# Altium project take1.PrjPcb
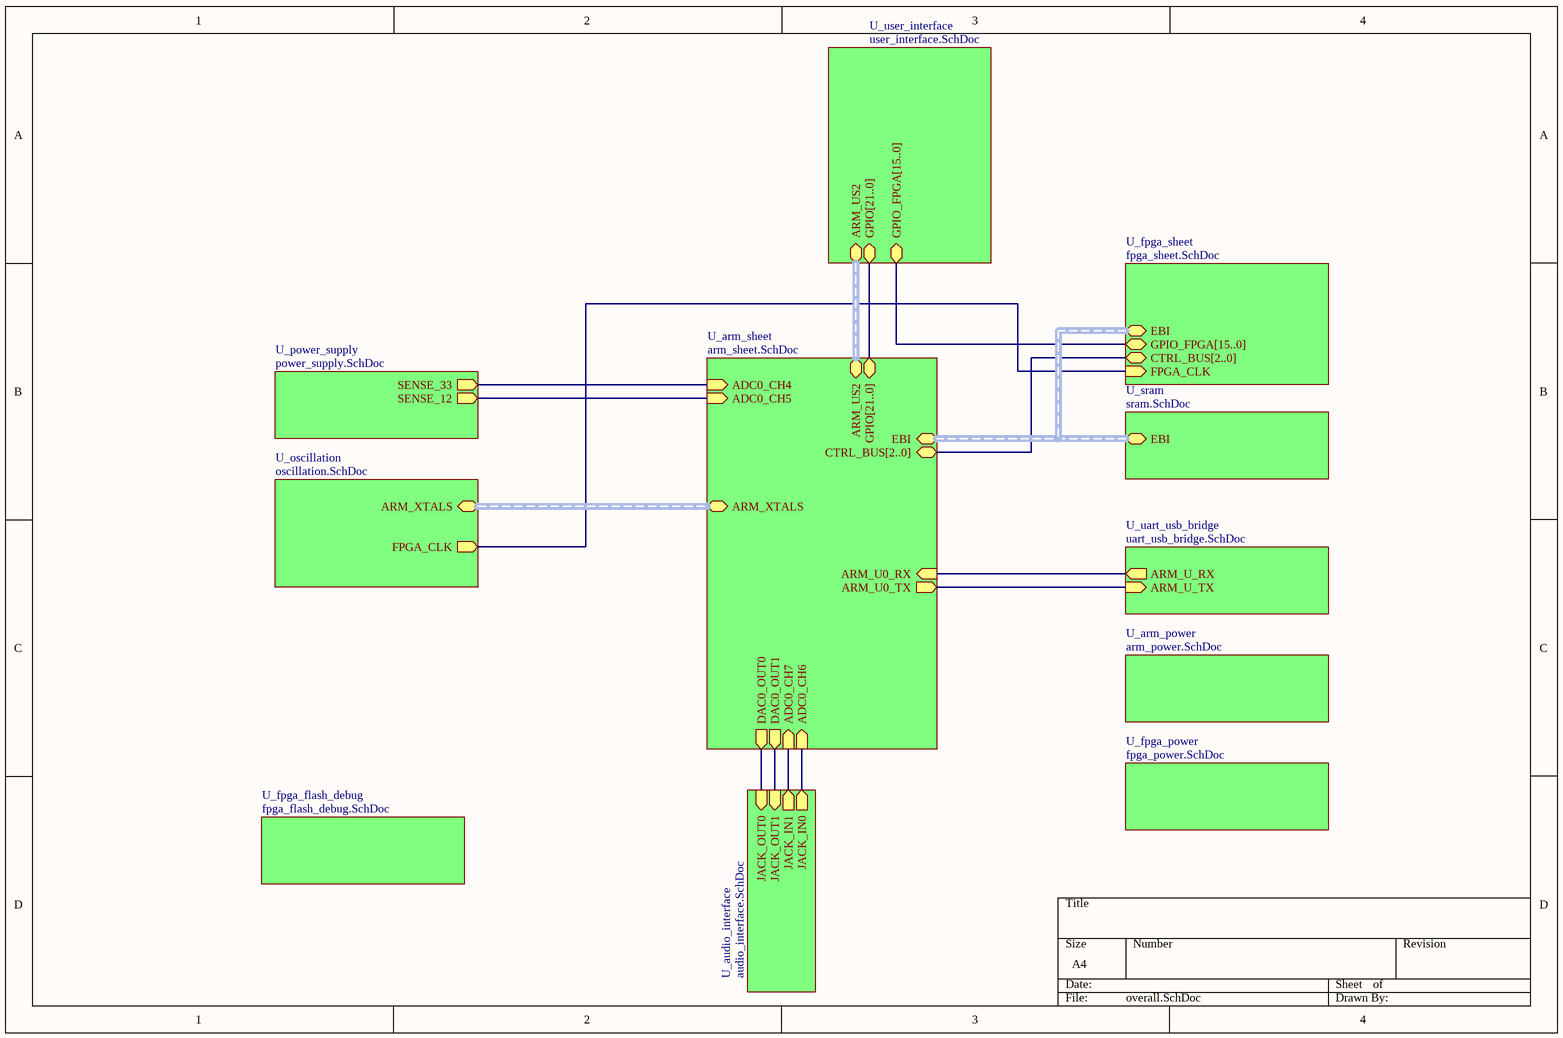
[diagram p0: overall.SchDoc]
12 sheets, 174 parts. Net scope: hierarchical (ports join the sheet entries above them; power ports are global).
Board files: pcb_take1.PcbDoc, pcb_take2-1.PcbDoc, pcb_take2.PcbDoc
Sheets:
  overall.SchDoc
    U_arm_power = arm_power.SchDoc
    U_arm_sheet = arm_sheet.SchDoc
    U_fpga_power = fpga_power.SchDoc
    U_oscillation = oscillation.SchDoc
    U_uart_usb_bridge = uart_usb_bridge.SchDoc
    U_user_interface = user_interface.SchDoc
    U_power_supply = power_supply.SchDoc
    U_fpga_sheet = fpga_sheet.SchDoc
    U_fpga_flash_debug = fpga_flash_debug.SchDoc
    U_audio_interface = audio_interface.SchDoc
    U_sram = sram.SchDoc

## Sheet overall.SchDoc
size A4

### Sub-sheets
U_arm_power = arm_power.SchDoc: no entries
U_arm_sheet = arm_sheet.SchDoc: ARM_U0_TX (out), ARM_U0_RX (in), ADC0_CH4 (in), ADC0_CH5 (in), ADC0_CH6 (in), ADC0_CH7 (in), CTRL_BUS[2..0] (bidir), ARM_XTALS (harness ARM_XTALS), ARM_US2 (harness ARM_US2), DAC0_OUT0 (out), DAC0_OUT1 (out), GPIO[21..0] (bidir), EBI (harness EBI)
U_audio_interface = audio_interface.SchDoc: JACK_IN0 (out), JACK_IN1 (out), JACK_OUT0 (in), JACK_OUT1 (in)
U_fpga_flash_debug = fpga_flash_debug.SchDoc: no entries
U_fpga_power = fpga_power.SchDoc: no entries
U_fpga_sheet = fpga_sheet.SchDoc: GPIO_FPGA[15..0] (bidir), CTRL_BUS[2..0] (bidir), FPGA_CLK (in), EBI (harness EBI)
U_oscillation = oscillation.SchDoc: FPGA_CLK (out), ARM_XTALS (harness ARM_XTALS)
U_power_supply = power_supply.SchDoc: SENSE_33 (out), SENSE_12 (out)
U_sram = sram.SchDoc: EBI (harness EBI)
U_uart_usb_bridge = uart_usb_bridge.SchDoc: ARM_U_TX (in), ARM_U_RX (out)
U_user_interface = user_interface.SchDoc: GPIO_FPGA[15..0] (bidir), GPIO[21..0] (bidir), ARM_US2 (harness ARM_US2)

### Nets
NetC62_1: sheet U_arm_sheet/ADC0_CH6, sheet U_audio_interface/JACK_IN0
NetC66_1: sheet U_arm_sheet/ADC0_CH7, sheet U_audio_interface/JACK_IN1
NetCG1_3: sheet U_oscillation/FPGA_CLK, sheet U_fpga_sheet/FPGA_CLK
NetGG_A6: sheet U_arm_sheet/ARM_U0_RX, sheet U_uart_usb_bridge/ARM_U_RX
NetGG_B7: sheet U_arm_sheet/ARM_U0_TX, sheet U_uart_usb_bridge/ARM_U_TX
NetGG_H9: sheet U_arm_sheet/ADC0_CH5, sheet U_power_supply/SENSE_12
NetGG_J11: sheet U_arm_sheet/ADC0_CH4, sheet U_power_supply/SENSE_33
NetGG_L5: sheet U_arm_sheet/DAC0_OUT0, sheet U_audio_interface/JACK_OUT0
NetGG_L6: sheet U_arm_sheet/DAC0_OUT1, sheet U_audio_interface/JACK_OUT1

### Buses and harness runs
bus sheet U_arm_sheet/CTRL_BUS[2..0] = sheet U_fpga_sheet/CTRL_BUS[2..0]
bus sheet U_arm_sheet/GPIO[21..0] = sheet U_user_interface/GPIO[21..0]
bus sheet U_fpga_sheet/GPIO_FPGA[15..0] = sheet U_user_interface/GPIO_FPGA[15..0]
harness sheet U_arm_sheet/ARM_US2 = sheet U_user_interface/ARM_US2
harness sheet U_arm_sheet/ARM_XTALS = sheet U_oscillation/ARM_XTALS
harness sheet U_arm_sheet/EBI = sheet U_fpga_sheet/EBI = sheet U_sram/EBI

## Sheet arm_power.SchDoc
size A4
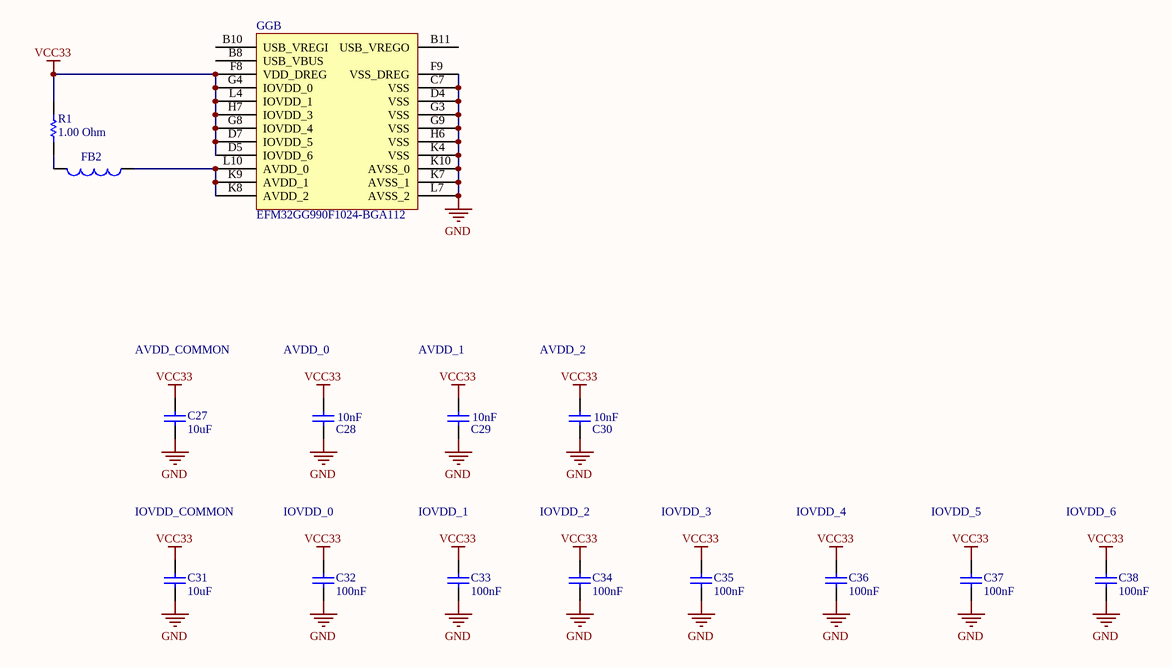
[diagram p1: arm_power.SchDoc]

### Parts
C27  10uF  [CAPC0805(2012)145_N]
C28  10nF  [CAPC0805(2012)75_N]
C29  10nF  [CAPC0805(2012)75_N]
C30  10nF  [CAPC0805(2012)75_N]
C31  10uF  [CAPC0805(2012)145_N]
C32  100nF  [CAPC0805(2012)100_M]
C33  100nF  [CAPC0805(2012)100_M]
C34  100nF  [CAPC0805(2012)100_M]
C35  100nF  [CAPC0805(2012)100_M]
C36  100nF  [CAPC0805(2012)100_M]
C37  100nF  [CAPC0805(2012)100_M]
C38  100nF  [CAPC0805(2012)100_M]
FB2  BLM21B102S or similar  [RESC3216N]  (value not drawn)
GG  EFM32GG990F1024-BGA112  [ENMR-BGA112]  (part B of 2)
R1  1.00 Ohm  [RESC0805(2012)_L]

### Nets
GND: C27.1 C28.1 C29.1 C30.1 C31.1 C32.1 C33.1 C34.1 C35.1 C36.1 C37.1 C38.1 GG.C7(VSS) GG.D4(VSS) GG.F9(VSS_DREG) GG.G3(VSS) GG.G9(VSS) GG.H6(VSS) GG.K4(VSS) GG.K7(AVSS_1) GG.K10(AVSS_0) GG.L7(AVSS_2)
VCC33: C27.2 C28.2 C29.2 C30.2 C31.2 C32.2 C33.2 C34.2 C35.2 C36.2 C37.2 C38.2 GG.D5(IOVDD_6) GG.D7(IOVDD_5) GG.F8(VDD_DREG) GG.G4(IOVDD_0) GG.G8(IOVDD_4) GG.H7(IOVDD_3) GG.L4(IOVDD_1) R1.2
NetFB2_1: FB2.1 GG.K8(AVDD_2) GG.K9(AVDD_1) GG.L10(AVDD_0)
NetFB2_2: FB2.2 R1.1

Not connected (* = marked no-connect by the designer): GG B8(USB_VBUS) B10(USB_VREGI) B11(USB_VREGO)

### Notes on the sheet
- AVDD_COMMON
- AVDD_0
- AVDD_1
- AVDD_2
- IOVDD_COMMON
- IOVDD_0
- IOVDD_1
- IOVDD_2
- IOVDD_3
- IOVDD_4
- IOVDD_5
- IOVDD_6

### Library data of the parts
C27 C31 = CMP-1036-04932-1: CAP 10uF 25V ±10% 0805 (2012 Metric) Thickness 1.45mm SMD; Case-EIA: 0805; Case-Metric: 2012; Technology: SMT; Value: 10uF; Rated Voltage: 25 V; Max Thickness: 1.45 mm; Tolerance: ±10%
C28-C30 = CMP-1036-03842-1: CAP 10nF 50V ±10% 0805 (2012 Metric) Thickness 0.75mm SMD; Case-Metric: 2012; Case-EIA: 0805; Value: 10nF; Max Thickness: 0.75 mm; Rated Voltage: 50 V; Tolerance: ±10%; Technology: SMT
C32-C38 = CMP-1036-04420-1: CAP 100nF 50V ±10% 0805 (2012 Metric) Thickness 1mm SMD; Case-EIA: 0805; Case-Metric: 2012; Rated Voltage: 50 V; Value: 100nF; Tolerance: ±10%; Max Thickness: 1 mm; Technology: SMT
FB2 = Inductor: Code_IEC: 1005; Value: 10mH; Published: 8-Jun-2000; LatestRevisionDate: 29-May-2009; LatestRevisionNote: IPC-7351 Footprint Added.; PackageReference: 0402-A; Publisher: Altium Limited; PackageDescription: Chip Inductor; Code_JEITA: 0402
GG = EFM32GG990F1024-BGA112: EFM32 Giant Gecko, M3 ARM Cortex CPU, 1024 KB Flash, 128 KB RAM, 1.85 - 3.8 V Supply, 48 MHz Max Speed, -40 to 85 degC, 112-Pin BGA, RoHS Compliant; Flash (KB): 1024; GPIO: 87; LCD: 8x34; LESENSE: Y; Max Speed (MHz): 48; OPAMPS: 3; RAM (KB): 128; DatasheetVersion: Rev 1.00; PackageVersion: Rev. 97SPP01315A_X03_06Jun11; PackageReference: BGA112; PackageDescription: 112-Pin Ball Grid Array, Body 10 x 10 mm, Pitch 0.8 mm; Supplier 1: Digi-Key; Supplier Part Number 1: 914-1051-2-ND; Supplier 2: Digi-Key; Supplier Part Number 2: 914-1051-1-ND; Supplier 3: Digi-Key; Supplier Part Number 3: 914-1051-6-ND; Supplier 4: Mouser; Supplier Part Number 4: 904-EFM32GG990F1024; ARM Cortex CPU: M3; Subcategory: EFM32 Giant Gecko; Supply Voltage (V): 1.85 - 3.8; USB: Y; Mounting Technology: Surface Mount; Generic Part Number: EFM32GG990; PartNumber: EFM32GG990F1024-BGA112; ComponentLink1Description: Manufacturer URL; ComponentLink1URL: http://www.energymicro.com/; ComponentLink2Description: Datasheet; ComponentLink2URL: http://cdn.energymicro.com/dl/devices/pdf/d0046_efm32gg990_datasheet.pdf; ComponentLink3Description: Package Specification; ComponentLink3URL: http://cdn.energymicro.com/dl/devices/pdf/d0007_efm32g290_datasheet.pdf
R1 = CMP-1013-00002-1: 1R 0.125W 5% 0805 (2012 Metric)  SMD; Case-EIA: 0805; Case-Metric: 2012; Power: 0.125 W; Tolerance: 5 %; Value: 1.00 Ohm; Technology: SMT

## Sheet arm_sheet.SchDoc
size A4
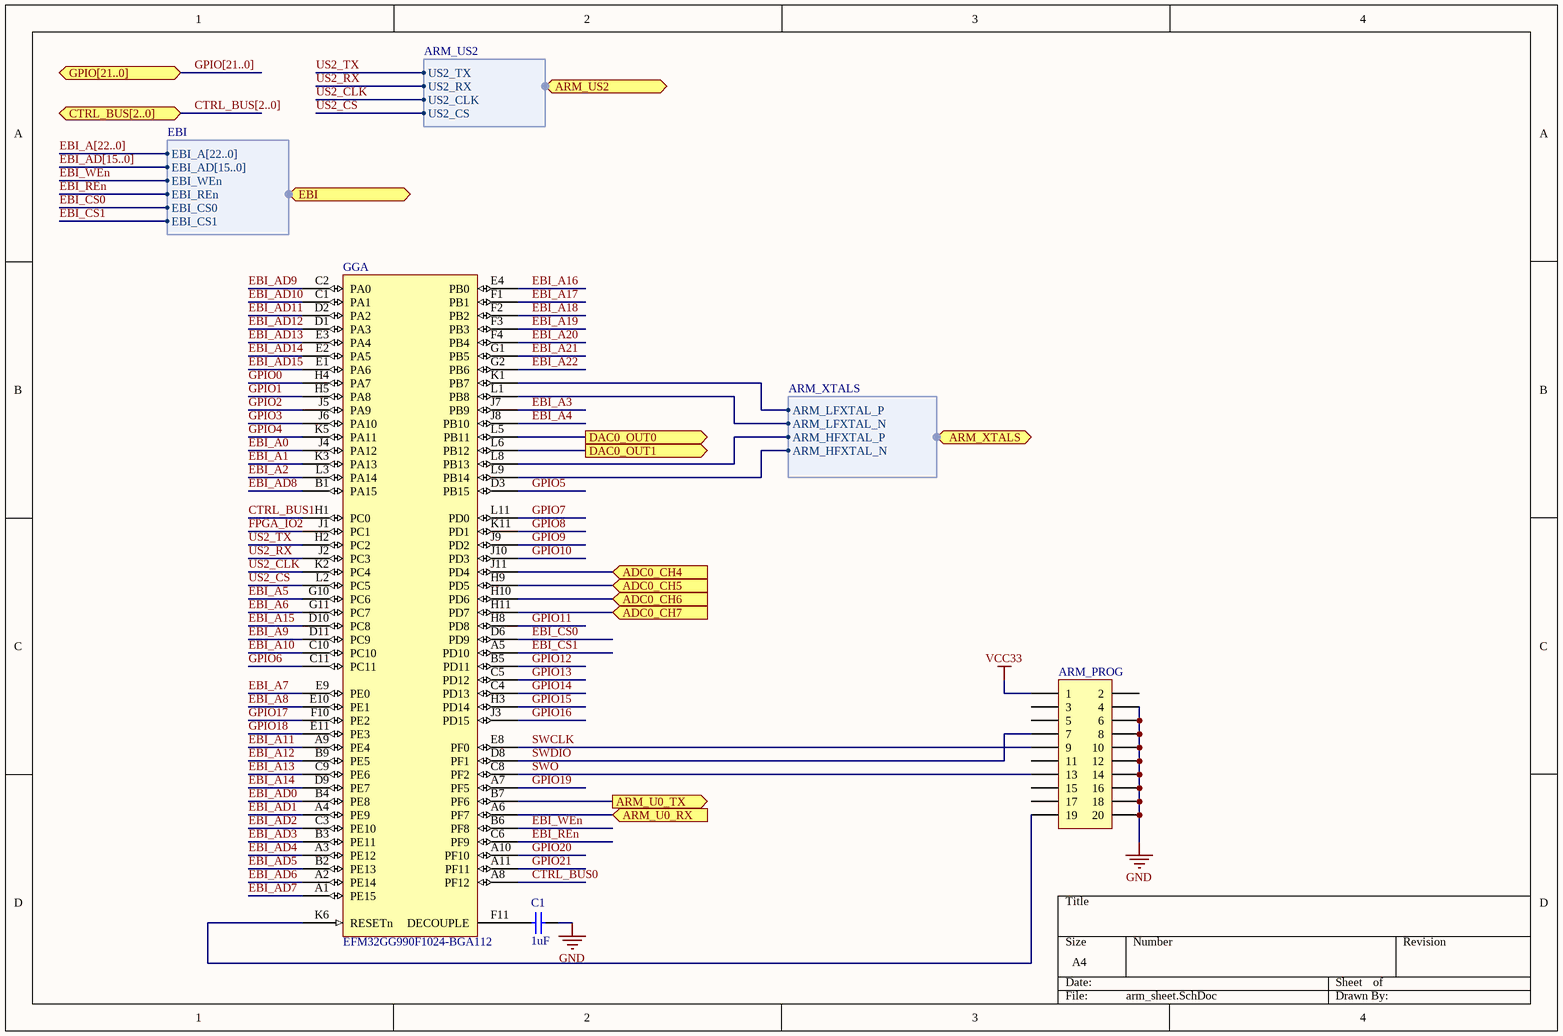
[diagram p2: arm_sheet.SchDoc]

### Parts
ARM_PROG  Header 10X2  [HDR2X10]  (value not drawn)
C1  1uF  [CAPC0805(2012)100_N]
GG  EFM32GG990F1024-BGA112  [ENMR-BGA112]  (part A of 2)

### Ports
ADC0_CH4 (in), ADC0_CH5 (in), ADC0_CH6 (in), ADC0_CH7 (in), ARM_U0_RX (in), ARM_U0_TX (out), ARM_US2 (harness ARM_US2), ARM_XTALS (harness ARM_XTALS), CTRL_BUS[2..0] (bidir), DAC0_OUT0 (out), DAC0_OUT1 (out), EBI (harness EBI), GPIO[21..0] (bidir)

### Harnesses
ARM_XTALS: ARM_LFXTAL_P, ARM_LFXTAL_N, ARM_HFXTAL_P, ARM_HFXTAL_N
EBI: EBI_A[22..0], EBI_AD[15..0], EBI_WEn, EBI_REn, EBI_CS0, EBI_CS1
ARM_US2: US2_TX, US2_RX, US2_CLK, US2_CS

### Nets
GND: ARM_PROG.4 ARM_PROG.6 ARM_PROG.8 ARM_PROG.10 ARM_PROG.12 ARM_PROG.14 ARM_PROG.16 ARM_PROG.18 ARM_PROG.20 C1.2
VCC33: ARM_PROG.1
ARM_HFXTAL_N: GG.L9(PB14) ; port ARM_XTALS.ARM_HFXTAL_N
ARM_HFXTAL_P: GG.L8(PB13) ; port ARM_XTALS.ARM_HFXTAL_P
ARM_LFXTAL_N: GG.L1(PB8) ; port ARM_XTALS.ARM_LFXTAL_N
ARM_LFXTAL_P: GG.K1(PB7) ; port ARM_XTALS.ARM_LFXTAL_P
CTRL_BUS0: GG.A8(PF12)
CTRL_BUS1: GG.H1(PC0)
EBI_A0: GG.J4(PA12)
EBI_A1: GG.K3(PA13)
EBI_A2: GG.L3(PA14)
EBI_A3: GG.J7(PB9)
EBI_A4: GG.J8(PB10)
EBI_A5: GG.G10(PC6)
EBI_A6: GG.G11(PC7)
EBI_A7: GG.E9(PE0)
EBI_A8: GG.E10(PE1)
EBI_A9: GG.D11(PC9)
EBI_A10: GG.C10(PC10)
EBI_A11: GG.A9(PE4)
EBI_A12: GG.B9(PE5)
EBI_A13: GG.C9(PE6)
EBI_A14: GG.D9(PE7)
EBI_A15: GG.D10(PC8)
EBI_A16: GG.E4(PB0)
EBI_A17: GG.F1(PB1)
EBI_A18: GG.F2(PB2)
EBI_A19: GG.F3(PB3)
EBI_A20: GG.F4(PB4)
EBI_A21: GG.G1(PB5)
EBI_A22: GG.G2(PB6)
EBI_AD0: GG.B4(PE8)
EBI_AD1: GG.A4(PE9)
EBI_AD2: GG.C3(PE10)
EBI_AD3: GG.B3(PE11)
EBI_AD4: GG.A3(PE12)
EBI_AD5: GG.B2(PE13)
EBI_AD6: GG.A2(PE14)
EBI_AD7: GG.A1(PE15)
EBI_AD8: GG.B1(PA15)
EBI_AD9: GG.C2(PA0)
EBI_AD10: GG.C1(PA1)
EBI_AD11: GG.D2(PA2)
EBI_AD12: GG.D1(PA3)
EBI_AD13: GG.E3(PA4)
EBI_AD14: GG.E2(PA5)
EBI_AD15: GG.E1(PA6)
EBI_CS0: GG.D6(PD9) ; port EBI.EBI_CS0
EBI_CS1: GG.A5(PD10) ; port EBI.EBI_CS1
EBI_REn: GG.C6(PF9) ; port EBI.EBI_REn
EBI_WEn: GG.B6(PF8) ; port EBI.EBI_WEn
FPGA_IO2: GG.J1(PC1)
GPIO0: GG.H4(PA7)
GPIO1: GG.H5(PA8)
GPIO2: GG.J5(PA9)
GPIO3: GG.J6(PA10)
GPIO4: GG.K5(PA11)
GPIO5: GG.D3(PB15)
GPIO6: GG.C11(PC11)
GPIO7: GG.L11(PD0)
GPIO8: GG.K11(PD1)
GPIO9: GG.J9(PD2)
GPIO10: GG.J10(PD3)
GPIO11: GG.H8(PD8)
GPIO12: GG.B5(PD11)
GPIO13: GG.C5(PD12)
GPIO14: GG.C4(PD13)
GPIO15: GG.H3(PD14)
GPIO16: GG.J3(PD15)
GPIO17: GG.F10(PE2)
GPIO18: GG.E11(PE3)
GPIO19: GG.A7(PF5)
GPIO20: GG.A10(PF10)
GPIO21: GG.A11(PF11)
SWCLK: ARM_PROG.9 GG.E8(PF0)
SWDIO: ARM_PROG.7 GG.D8(PF1)
SWO: ARM_PROG.13 GG.C8(PF2)
US2_CLK: GG.K2(PC4) ; port ARM_US2.US2_CLK
US2_CS: GG.L2(PC5) ; port ARM_US2.US2_CS
US2_RX: GG.J2(PC3) ; port ARM_US2.US2_RX
US2_TX: GG.H2(PC2) ; port ARM_US2.US2_TX
NetARM_PROG_19: ARM_PROG.19 GG.K6(RESETn)
NetC1_1: C1.1 GG.F11(DECOUPLE)
NetC62_1: GG.H10(PD6) ; port ADC0_CH6
NetC66_1: GG.H11(PD7) ; port ADC0_CH7
NetGG_A6: GG.A6(PF7) ; port ARM_U0_RX
NetGG_B7: GG.B7(PF6) ; port ARM_U0_TX
NetGG_H9: GG.H9(PD5) ; port ADC0_CH5
NetGG_J11: GG.J11(PD4) ; port ADC0_CH4
NetGG_L5: GG.L5(PB11) ; port DAC0_OUT0
NetGG_L6: GG.L6(PB12) ; port DAC0_OUT1

Not connected (* = marked no-connect by the designer): ARM_PROG 2 3 5 11 15 17

### Buses and harness runs
bus CTRL_BUS[2..0] = port CTRL_BUS[2..0]
bus EBI_A[22..0]
bus EBI_AD[15..0]
bus GPIO[21..0] = port GPIO[21..0]

### Library data of the parts
ARM_PROG = Header 10X2: Header, 10-Pin, Dual row; LatestRevisionDate: 17-Jul-2002; LatestRevisionNote: Re-released for DXP Platform.; Publisher: Altium Limited
C1 = CMP-1036-04747-1: CAP 1uF 16V ±10% 0805 (2012 Metric) Thickness 1mm SMD; Case-Metric: 2012; Case-EIA: 0805; Tolerance: ±10%; Technology: SMT; Value: 1uF; Rated Voltage: 16 V; Max Thickness: 1 mm
GG = EFM32GG990F1024-BGA112: as GG on sheet arm_power; DatasheetVersion: Rev 1.00; PackageVersion: Rev. 97SPP01315A_X03_06Jun11; PackageReference: BGA112; PackageDescription: 112-Pin Ball Grid Array, Body 10 x 10 mm, Pitch 0.8 mm; Supplier 1: Digi-Key; Supplier Part Number 1: 914-1051-2-ND; Supplier 2: Digi-Key; Supplier Part Number 2: 914-1051-1-ND; Supplier 3: Digi-Key; Supplier Part Number 3: 914-1051-6-ND; Supplier 4: Mouser; Supplier Part Number 4: 904-EFM32GG990F1024; ARM Cortex CPU: M3; Subcategory: EFM32 Giant Gecko; Supply Voltage (V): 1.85 - 3.8; USB: Y; Mounting Technology: Surface Mount; Generic Part Number: EFM32GG990; PartNumber: EFM32GG990F1024-BGA112; ComponentLink1Description: Manufacturer URL; ComponentLink1URL: http://www.energymicro.com/; ComponentLink2Description: Datasheet; ComponentLink2URL: http://cdn.energymicro.com/dl/devices/pdf/d0046_efm32gg990_datasheet.pdf; ComponentLink3Description: Package Specification; ComponentLink3URL: http://cdn.energymicro.com/dl/devices/pdf/d0007_efm32g290_datasheet.pdf

## Sheet fpga_power.SchDoc
size A4
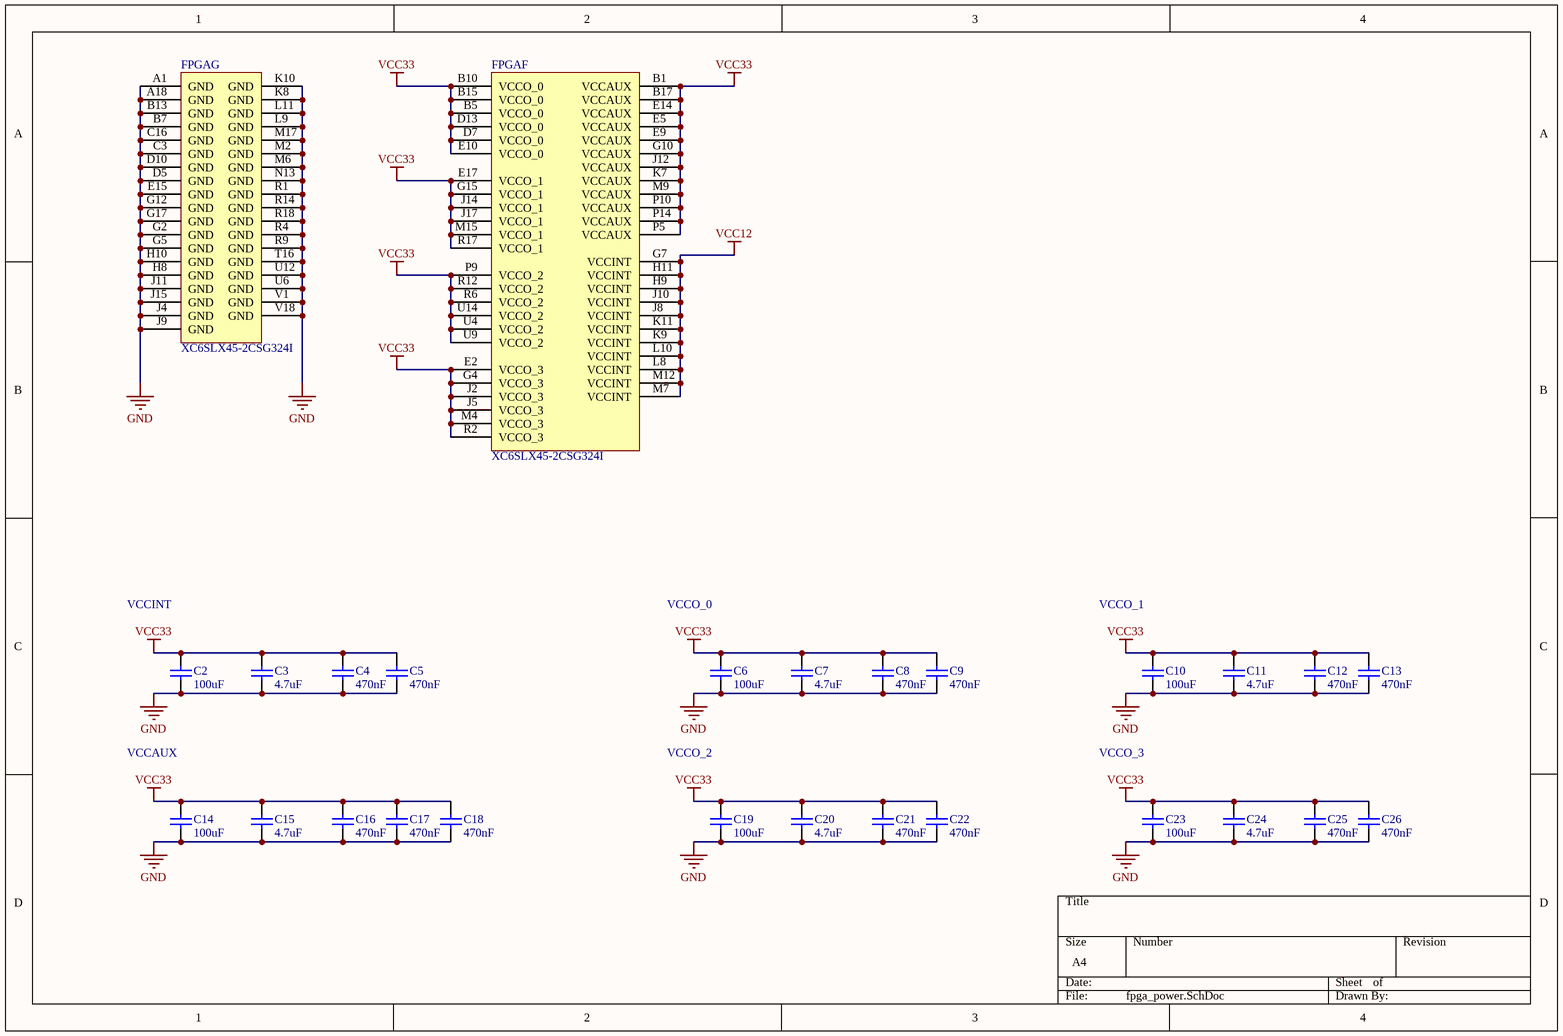
[diagram p3: fpga_power.SchDoc]

### Parts
C2  100uF  [CAPC1210(3225)280A_M]
C3  4.7uF  [CAPC0805(2012)145_N]
C4  470nF  [CAPC0805(2012)100_N]
C5  470nF  [CAPC0805(2012)100_N]
C6  100uF  [CAPC1210(3225)280A_M]
C7  4.7uF  [CAPC0805(2012)145_N]
C8  470nF  [CAPC0805(2012)100_N]
C9  470nF  [CAPC0805(2012)100_N]
C10  100uF  [CAPC1210(3225)280A_M]
C11  4.7uF  [CAPC0805(2012)145_N]
C12  470nF  [CAPC0805(2012)100_N]
C13  470nF  [CAPC0805(2012)100_N]
C14  100uF  [CAPC1210(3225)280A_M]
C15  4.7uF  [CAPC0805(2012)145_N]
C16  470nF  [CAPC0805(2012)100_N]
C17  470nF  [CAPC0805(2012)100_N]
C18  470nF  [CAPC0805(2012)100_N]
C19  100uF  [CAPC1210(3225)280A_M]
C20  4.7uF  [CAPC0805(2012)145_N]
C21  470nF  [CAPC0805(2012)100_N]
C22  470nF  [CAPC0805(2012)100_N]
C23  100uF  [CAPC1210(3225)280A_M]
C24  4.7uF  [CAPC0805(2012)145_N]
C25  470nF  [CAPC0805(2012)100_N]
C26  470nF  [CAPC0805(2012)100_N]
FPGA  XC6SLX45-2CSG324I  [CSG324]  (parts F,G of 8)

### Nets
GND: C2.1 C3.1 C4.1 C5.1 C6.1 C7.1 C8.1 C9.1 C10.1 C11.1 C12.1 C13.1 C14.1 C15.1 C16.1 C17.1 C18.1 C19.1 C20.1 C21.1 C22.1 C23.1 C24.1 C25.1 C26.1 FPGA.A1(GND) FPGA.A18(GND) FPGA.B7(GND) FPGA.B13(GND) FPGA.C3(GND) FPGA.C16(GND) FPGA.D5(GND) FPGA.D10(GND) FPGA.E15(GND) FPGA.G2(GND) FPGA.G5(GND) FPGA.G12(GND) FPGA.G17(GND) FPGA.H8(GND) FPGA.H10(GND) FPGA.J4(GND) FPGA.J9(GND) FPGA.J11(GND) FPGA.J15(GND) FPGA.K8(GND) FPGA.K10(GND) FPGA.L9(GND) FPGA.L11(GND) FPGA.M2(GND) FPGA.M6(GND) FPGA.M17(GND) FPGA.N13(GND) FPGA.R1(GND) FPGA.R4(GND) FPGA.R9(GND) FPGA.R14(GND) FPGA.R18(GND) FPGA.T16(GND) FPGA.U6(GND) FPGA.U12(GND) FPGA.V1(GND) FPGA.V18(GND)
VCC12: FPGA.G7(VCCINT) FPGA.H9(VCCINT) FPGA.H11(VCCINT) FPGA.J8(VCCINT) FPGA.J10(VCCINT) FPGA.K9(VCCINT) FPGA.K11(VCCINT) FPGA.L8(VCCINT) FPGA.L10(VCCINT) FPGA.M7(VCCINT) FPGA.M12(VCCINT)
VCC33: C2.2 C3.2 C4.2 C5.2 C6.2 C7.2 C8.2 C9.2 C10.2 C11.2 C12.2 C13.2 C14.2 C15.2 C16.2 C17.2 C18.2 C19.2 C20.2 C21.2 C22.2 C23.2 C24.2 C25.2 C26.2 FPGA.B1(VCCAUX) FPGA.B5(VCCO_0) FPGA.B10(VCCO_0) FPGA.B15(VCCO_0) FPGA.B17(VCCAUX) FPGA.D7(VCCO_0) FPGA.D13(VCCO_0) FPGA.E2(VCCO_3) FPGA.E5(VCCAUX) FPGA.E9(VCCAUX) FPGA.E10(VCCO_0) FPGA.E14(VCCAUX) FPGA.E17(VCCO_1) FPGA.G4(VCCO_3) FPGA.G10(VCCAUX) FPGA.G15(VCCO_1) FPGA.J2(VCCO_3) FPGA.J5(VCCO_3) FPGA.J12(VCCAUX) FPGA.J14(VCCO_1) FPGA.J17(VCCO_1) FPGA.K7(VCCAUX) FPGA.M4(VCCO_3) FPGA.M9(VCCAUX) FPGA.M15(VCCO_1) FPGA.P5(VCCAUX) FPGA.P9(VCCO_2) FPGA.P10(VCCAUX) FPGA.P14(VCCAUX) FPGA.R2(VCCO_3) FPGA.R6(VCCO_2) FPGA.R12(VCCO_2) FPGA.R17(VCCO_1) FPGA.U4(VCCO_2) FPGA.U9(VCCO_2) FPGA.U14(VCCO_2)

### Notes on the sheet
- VCCINT
- VCCO_0
- VCCO_1
- VCCAUX
- VCCO_2
- VCCO_3

### Library data of the parts
C2 C6 C10 C14 C19 C23 = CMP-1038-02303-1: CAP 100uF 6.3V ±20% 1210 (3225 Metric) Thickness 2.8mm SMD; Case-Metric: 3225; Case-EIA: 1210; Rated Voltage: 6.3 V; Max Thickness: 2.8 mm; Tolerance: ±20%; Value: 100uF; Technology: SMT
C3 C7 C11 C15 C20 C24 = CMP-1036-04881-1: CAP 4.7uF 10V ±10% 0805 (2012 Metric) Thickness 1.45mm SMD; Case-EIA: 0805; Case-Metric: 2012; Tolerance: ±10%; Technology: SMT; Max Thickness: 1.45 mm; Value: 4.7uF; Rated Voltage: 10 V
C4 C5 C8 C9 C12 C13 C16-C18 C21 C22 C25 C26 = CMP-1036-04639-1: CAP 470nF 16V ±10% 0805 (2012 Metric) Thickness 1mm SMD; Case-EIA: 0805; Case-Metric: 2012; Rated Voltage: 16 V; Max Thickness: 1 mm; Value: 470nF; Tolerance: ±10%; Technology: SMT
FPGA = XC6SLX45-2CSG324I: Spartan-6 LX 1.2V FPGA, 218 User I/Os, 324-Ball Chip-Scale BGA (0.8mm Pitch), Speed Grade 2, Industrial Grade, Pb-Free; DatasheetVersion: ver1.6, Nov-2010; PackageVersion: ver1.1, Nov-2009; PackageReference: CSG324; PackageDescription: 324-Ball Chip-Scale BGA (CSG324) Package, 0.8 mm Pitch; Code_JEDEC: MO-275-KKAC-1; ComponentLink1Description: Manufacturer URL; ComponentLink1URL: http://www.xilinx.com/; ComponentLink2Description: Spartan-6 Datasheet; ComponentLink2URL: http://www.xilinx.com/support/documentation/data_sheets/ds160.pdf; ComponentLink3Description: Spartan-6 Documents; ComponentLink3URL: http://www.xilinx.com/support/documentation/spartan-6.htm

## Sheet oscillation.SchDoc
size A4
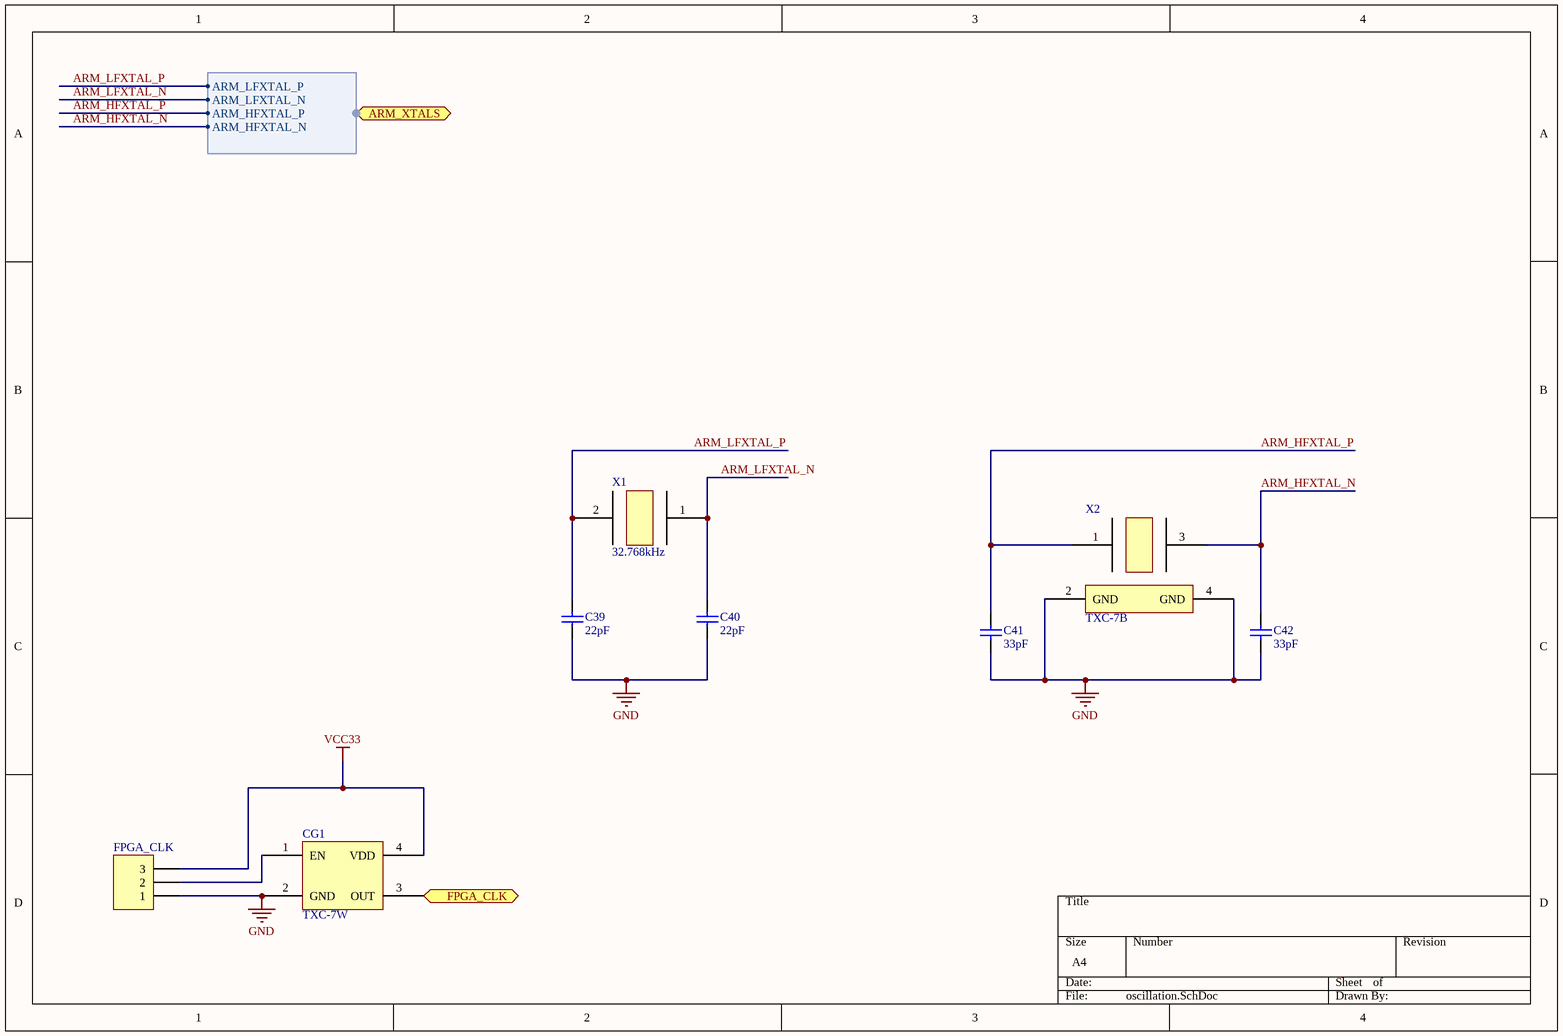
[diagram p4: oscillation.SchDoc]

### Parts
C39  22pF  [CAPC0805(2012)75_L]
C40  22pF  [CAPC0805(2012)75_L]
C41  33pF  [CAPC0805(2012)75_L]
C42  33pF  [CAPC0805(2012)75_L]
CG1  TXC-7W  [TXC-7W]
FPGA_CLK  Header 3  [HDR1X3]  (value not drawn)
X1  32.768kHz  [MC-306]
X2  TXC-7B  [TXC-7B]

### Ports
ARM_XTALS (harness ARM_XTALS), FPGA_CLK (out)

### Harnesses
ARM_XTALS: ARM_LFXTAL_P, ARM_LFXTAL_N, ARM_HFXTAL_P, ARM_HFXTAL_N

### Nets
GND: C39.1 C40.1 C41.2 C42.2 CG1.2(GND) FPGA_CLK.1 X2.2(GND) X2.4(GND)
VCC33: CG1.4(VDD) FPGA_CLK.3
ARM_HFXTAL_N: C42.1 X2.3 ; port ARM_XTALS.ARM_HFXTAL_N
ARM_HFXTAL_P: C41.1 X2.1 ; port ARM_XTALS.ARM_HFXTAL_P
ARM_LFXTAL_N: C40.2 X1.1 ; port ARM_XTALS.ARM_LFXTAL_N
ARM_LFXTAL_P: C39.2 X1.2 ; port ARM_XTALS.ARM_LFXTAL_P
NetCG1_1: CG1.1(EN) FPGA_CLK.2
NetCG1_3: CG1.3(OUT) ; port FPGA_CLK

### Library data of the parts
C39 C40 = CMP-1036-01219-1: CAP 22pF 16V ±5% 0805 (2012 Metric) Thickness 0.75mm SMD; Case-Metric: 2012; Case-EIA: 0805; Technology: SMT; Max Thickness: 0.75 mm; Value: 22pF; Tolerance: ±5%; Rated Voltage: 16 V
C41 C42 = CMP-1036-01407-1: CAP 33pF 16V ±5% 0805 (2012 Metric) Thickness 0.75mm SMD; Case-Metric: 2012; Case-EIA: 0805; Value: 33pF; Max Thickness: 0.75 mm; Technology: SMT; Tolerance: ±5%; Rated Voltage: 16 V
FPGA_CLK = Header 3: Header, 3-Pin; LatestRevisionDate: 17-Jul-2002; LatestRevisionNote: Re-released for DXP Platform.; Publisher: Altium Limited
X1 = MC-306

## Sheet uart_usb_bridge.SchDoc
size A4
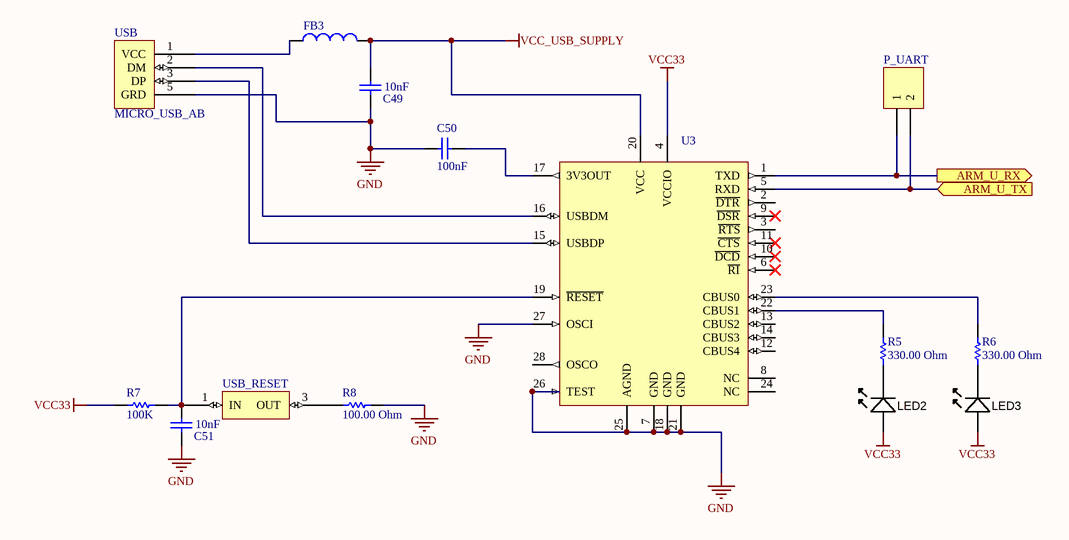
[diagram p5: uart_usb_bridge.SchDoc]

### Parts
C49  10nF  [CAPC0805(2012)75_N]
C50  100nF  [CAPC0805(2012)100_M]
C51  10nF  [CAPC0805(2012)75_N]
FB3  Inductor  [INDC3216]  (value not drawn)
LED2  Red  [LED-0805-A]  (value not drawn)
LED3  Red  [LED-0805-A]  (value not drawn)
P_UART  Header 2  [HDR1X2]  (value not drawn)
R5  330.00 Ohm  [RESC0805(2012)_M]
R6  330.00 Ohm  [RESC0805(2012)_M]
R7  100K  [RESC0805(2012)_L]
R8  100.00 Ohm  [RESC0805(2012)_M]
U3  FT232RL-Reel  [SSOP-28_N]  (value not drawn)
USB  MICRO_USB_AB  [MICRO_USB_AB]
USB_RESET  BUTTON  [BUTTON]  (value not drawn)

### Ports
ARM_U_RX (out), ARM_U_TX (in)

### Nets
GND: C49.1 C50.2 C51.1 R8.2 U3.7(GND) U3.18(GND) U3.21(GND) U3.25(AGND) U3.26(TEST) U3.27(OSCI) USB.5(GRD)
VCC33: LED2.A LED3.A R7.2 U3.4(VCCIO)
VCC_USB_SUPPLY: C49.2 FB3.2 U3.20(VCC)
NetC50_1: C50.1 U3.17(3V3OUT)
NetC51_2: C51.2 R7.1 U3.19(~{RESET}) USB_RESET.1(IN)
NetFB3_1: FB3.1 USB.1(VCC)
NetGG_A6: P_UART.1 U3.1(TXD) ; port ARM_U_RX
NetGG_B7: P_UART.2 U3.5(RXD) ; port ARM_U_TX
NetLED2_K: LED2.K R5.1
NetLED3_K: LED3.K R6.1
NetR5_2: R5.2 U3.22(CBUS1)
NetR6_2: R6.2 U3.23(CBUS0)
NetR8_1: R8.1 USB_RESET.3(OUT)
NetU3_15: U3.15(USBDP) USB.3(DP)
NetU3_16: U3.16(USBDM) USB.2(DM)

Not connected (* = marked no-connect by the designer): U3 2(~{DTR}) 3(~{RTS}) 6(~{RI})* 8(NC) 9(~{DSR})* 10(~{DCD})* 11(~{CTS})* 12(CBUS4) 13(CBUS2) 14(CBUS3) 24(NC) 28(OSCO)

### Library data of the parts
C49 C51 = CMP-1036-03842-1: as C28 on sheet arm_power; Value: 10nF; Max Thickness: 0.75 mm; Rated Voltage: 50 V; Tolerance: ±10%; Technology: SMT
C50 = CMP-1036-04420-1: as C32 on sheet arm_power; Rated Voltage: 50 V; Value: 100nF; Tolerance: ±10%; Max Thickness: 1 mm; Technology: SMT
FB3 = Inductor: Value: 10mH; Code_IEC: 1005; Published: 8-Jun-2000; LatestRevisionDate: 29-May-2009; LatestRevisionNote: IPC-7351 Footprint Added.; PackageReference: 0402-A; Publisher: Altium Limited; PackageDescription: Chip Inductor; Code_JEITA: 0402
LED2 LED3 = LED_SMD_Red_0805: LED, 0805 SMD, Red; Manufacturer 1: Ligitek; Manufacturer Part Number 1: LG170SR-CT; Material: GaAIAs; Ratings: 20 mcd; 643 nm; Package / Case: 0805
P_UART = Header 2: Header, 2-Pin; LatestRevisionDate: 17-Jul-2002; LatestRevisionNote: Re-released for DXP Platform.; Publisher: Altium Limited
R5 R6 = CMP-1013-00454-1: 330R 0.125W 1% 0805 (2012 Metric)  SMD; Case-EIA: 0805; Case-Metric: 2012; Value: 330.00 Ohm; Power: 0.125 W; Tolerance: 1 %; Technology: SMT
R7 = CMP-1013-00122-1: 100K 0.125W 5% 0805 (2012 Metric)  SMD; Case-Metric: 2012; Value: 100000.00 Ohm; Case-EIA: 0805; Tolerance: 5 %; Technology: SMT; Power: 0.125 W
R8 = CMP-1013-00050-1: 100R 0.125W 5% 0805 (2012 Metric)  SMD; Case-EIA: 0805; Case-Metric: 2012; Tolerance: 5 %; Power: 0.125 W; Technology: SMT; Value: 100.00 Ohm
U3 = FT232RL-Reel: USB UART Asynchronous Serial Data Transfer Chip, SSOP-28, Tape and Reel; DatasheetVersion: ver 2.09, Apr-2011; PackageVersion: 2010; PackageReference: SSOP-28; PackageDescription: 28-Pin Small Outline Package 0.65 mm Pitch; ComponentLink1Description: Manufacturer URL; ComponentLink1URL: http://www.ftdichip.com/; ComponentLink2Description: Datasheet; ComponentLink2URL: http://www.ftdichip.com/Support/Documents/DataSheets/ICs/DS_FT232R.pdf

## Sheet user_interface.SchDoc
size A4
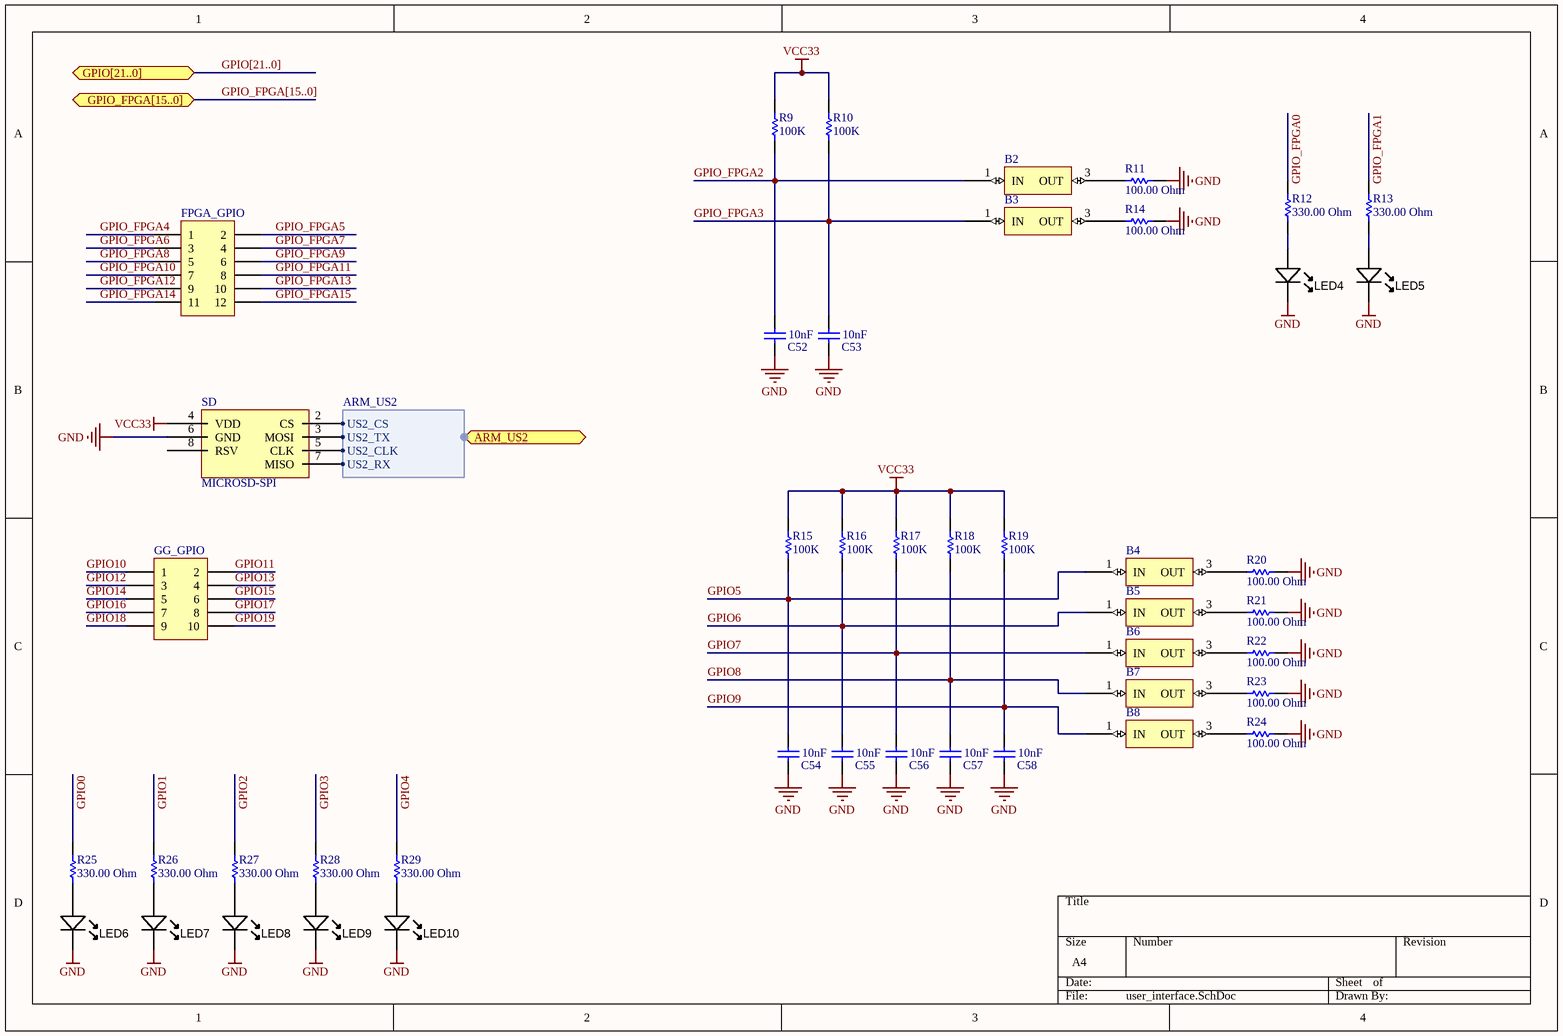
[diagram p6: user_interface.SchDoc]

### Parts
B2  BUTTON  [BUTTON]  (value not drawn)
B3  BUTTON  [BUTTON]  (value not drawn)
B4  BUTTON  [BUTTON]  (value not drawn)
B5  BUTTON  [BUTTON]  (value not drawn)
B6  BUTTON  [BUTTON]  (value not drawn)
B7  BUTTON  [BUTTON]  (value not drawn)
B8  BUTTON  [BUTTON]  (value not drawn)
C52  10nF  [CAPC0805(2012)75_N]
C53  10nF  [CAPC0805(2012)75_N]
C54  10nF  [CAPC0805(2012)75_N]
C55  10nF  [CAPC0805(2012)75_N]
C56  10nF  [CAPC0805(2012)75_N]
C57  10nF  [CAPC0805(2012)75_N]
C58  10nF  [CAPC0805(2012)75_N]
FPGA_GPIO  Header 6X2  [HDR2X6]  (value not drawn)
GG_GPIO  Header 5X2  [HDR2X5]  (value not drawn)
LED4  Green  [LED-0805-K]  (value not drawn)
LED5  Green  [LED-0805-K]  (value not drawn)
LED6  Green  [LED-0805-K]  (value not drawn)
LED7  Green  [LED-0805-K]  (value not drawn)
LED8  Green  [LED-0805-K]  (value not drawn)
LED9  Green  [LED-0805-K]  (value not drawn)
LED10  Green  [LED-0805-K]  (value not drawn)
R9  100K  [RESC0805(2012)_L]
R10  100K  [RESC0805(2012)_L]
R11  100.00 Ohm  [RESC0805(2012)_M]
R12  330.00 Ohm  [RESC0805(2012)_M]
R13  330.00 Ohm  [RESC0805(2012)_M]
R14  100.00 Ohm  [RESC0805(2012)_M]
R15  100K  [RESC0805(2012)_L]
R16  100K  [RESC0805(2012)_L]
R17  100K  [RESC0805(2012)_L]
R18  100K  [RESC0805(2012)_L]
R19  100K  [RESC0805(2012)_L]
R20  100.00 Ohm  [RESC0805(2012)_M]
R21  100.00 Ohm  [RESC0805(2012)_M]
R22  100.00 Ohm  [RESC0805(2012)_M]
R23  100.00 Ohm  [RESC0805(2012)_M]
R24  100.00 Ohm  [RESC0805(2012)_M]
R25  330.00 Ohm  [RESC0805(2012)_M]
R26  330.00 Ohm  [RESC0805(2012)_M]
R27  330.00 Ohm  [RESC0805(2012)_M]
R28  330.00 Ohm  [RESC0805(2012)_M]
R29  330.00 Ohm  [RESC0805(2012)_M]
SD  MICROSD-SPI  [MICROSD_WR-CRD]

### Ports
ARM_US2 (harness ARM_US2), GPIO[21..0] (bidir), GPIO_FPGA[15..0] (bidir)

### Harnesses
ARM_US2: US2_TX, US2_RX, US2_CLK, US2_CS

### Nets
GND: C52.1 C53.1 C54.1 C55.1 C56.1 C57.1 C58.1 LED4.K LED5.K LED6.K LED7.K LED8.K LED9.K LED10.K R11.2 R14.2 R20.2 R21.2 R22.2 R23.2 R24.2 SD.6(GND)
VCC33: R9.2 R10.2 R15.2 R16.2 R17.2 R18.2 R19.2 SD.4(VDD)
GPIO0: R25.2
GPIO1: R26.2
GPIO2: R27.2
GPIO3: R28.2
GPIO4: R29.2
GPIO5: B4.1(IN) C54.2 R15.1
GPIO6: B5.1(IN) C55.2 R16.1
GPIO7: B6.1(IN) C56.2 R17.1
GPIO8: B7.1(IN) C57.2 R18.1
GPIO9: B8.1(IN) C58.2 R19.1
GPIO10: GG_GPIO.1
GPIO11: GG_GPIO.2
GPIO12: GG_GPIO.3
GPIO13: GG_GPIO.4
GPIO14: GG_GPIO.5
GPIO15: GG_GPIO.6
GPIO16: GG_GPIO.7
GPIO17: GG_GPIO.8
GPIO18: GG_GPIO.9
GPIO19: GG_GPIO.10
GPIO_FPGA0: R12.2
GPIO_FPGA1: R13.2
GPIO_FPGA2: B2.1(IN) C52.2 R9.1
GPIO_FPGA3: B3.1(IN) C53.2 R10.1
GPIO_FPGA4: FPGA_GPIO.1
GPIO_FPGA5: FPGA_GPIO.2
GPIO_FPGA6: FPGA_GPIO.3
GPIO_FPGA7: FPGA_GPIO.4
GPIO_FPGA8: FPGA_GPIO.5
GPIO_FPGA9: FPGA_GPIO.6
GPIO_FPGA10: FPGA_GPIO.7
GPIO_FPGA11: FPGA_GPIO.8
GPIO_FPGA12: FPGA_GPIO.9
GPIO_FPGA13: FPGA_GPIO.10
GPIO_FPGA14: FPGA_GPIO.11
GPIO_FPGA15: FPGA_GPIO.12
US2_CLK: SD.5(CLK) ; port ARM_US2.US2_CLK
US2_CS: SD.2(CS) ; port ARM_US2.US2_CS
US2_RX: SD.7(MISO) ; port ARM_US2.US2_RX
US2_TX: SD.3(MOSI) ; port ARM_US2.US2_TX
NetB2_3: B2.3(OUT) R11.1
NetB3_3: B3.3(OUT) R14.1
NetB4_3: B4.3(OUT) R20.1
NetB5_3: B5.3(OUT) R21.1
NetB6_3: B6.3(OUT) R22.1
NetB7_3: B7.3(OUT) R23.1
NetB8_3: B8.3(OUT) R24.1
NetLED4_A: LED4.A R12.1
NetLED5_A: LED5.A R13.1
NetLED6_A: LED6.A R25.1
NetLED7_A: LED7.A R26.1
NetLED8_A: LED8.A R27.1
NetLED9_A: LED9.A R28.1
NetLED10_A: LED10.A R29.1

Not connected (* = marked no-connect by the designer): SD 8(RSV)

### Buses and harness runs
bus GPIO[21..0] = port GPIO[21..0]
bus GPIO_FPGA[15..0] = port GPIO_FPGA[15..0]

### Library data of the parts
C52-C58 = CMP-1036-03842-1: as C28 on sheet arm_power; Value: 10nF; Max Thickness: 0.75 mm; Rated Voltage: 50 V; Tolerance: ±10%; Technology: SMT
FPGA_GPIO = Header 6X2: Header, 6-Pin, Dual row; LatestRevisionDate: 17-Jul-2002; LatestRevisionNote: Re-released for DXP Platform.; Publisher: Altium Limited
GG_GPIO = Header 5X2: Header, 5-Pin, Dual row; LatestRevisionDate: 17-Jul-2002; LatestRevisionNote: Re-released for DXP Platform.; Publisher: Altium Limited
LED4-LED10 = LED_SMD_Green_0805: LED, 0805 SMD, Green; Manufacturer 1: Ligitek; Manufacturer Part Number 1: LG170G-CT; Material: GaP; Ratings: 10 mcd; 573 nm; Package / Case: 0805
R9 R10 R15-R19 = CMP-1013-00122-1: as R7 on sheet uart_usb_bridge; Tolerance: 5 %; Technology: SMT; Power: 0.125 W
R11 R14 R20-R24 = CMP-1013-00050-1: as R8 on sheet uart_usb_bridge; Tolerance: 5 %; Power: 0.125 W; Technology: SMT; Value: 100.00 Ohm
R12 R13 R25-R29 = CMP-1013-00454-1: as R5 on sheet uart_usb_bridge; Value: 330.00 Ohm; Power: 0.125 W; Tolerance: 1 %; Technology: SMT

## Sheet power_supply.SchDoc
size A4
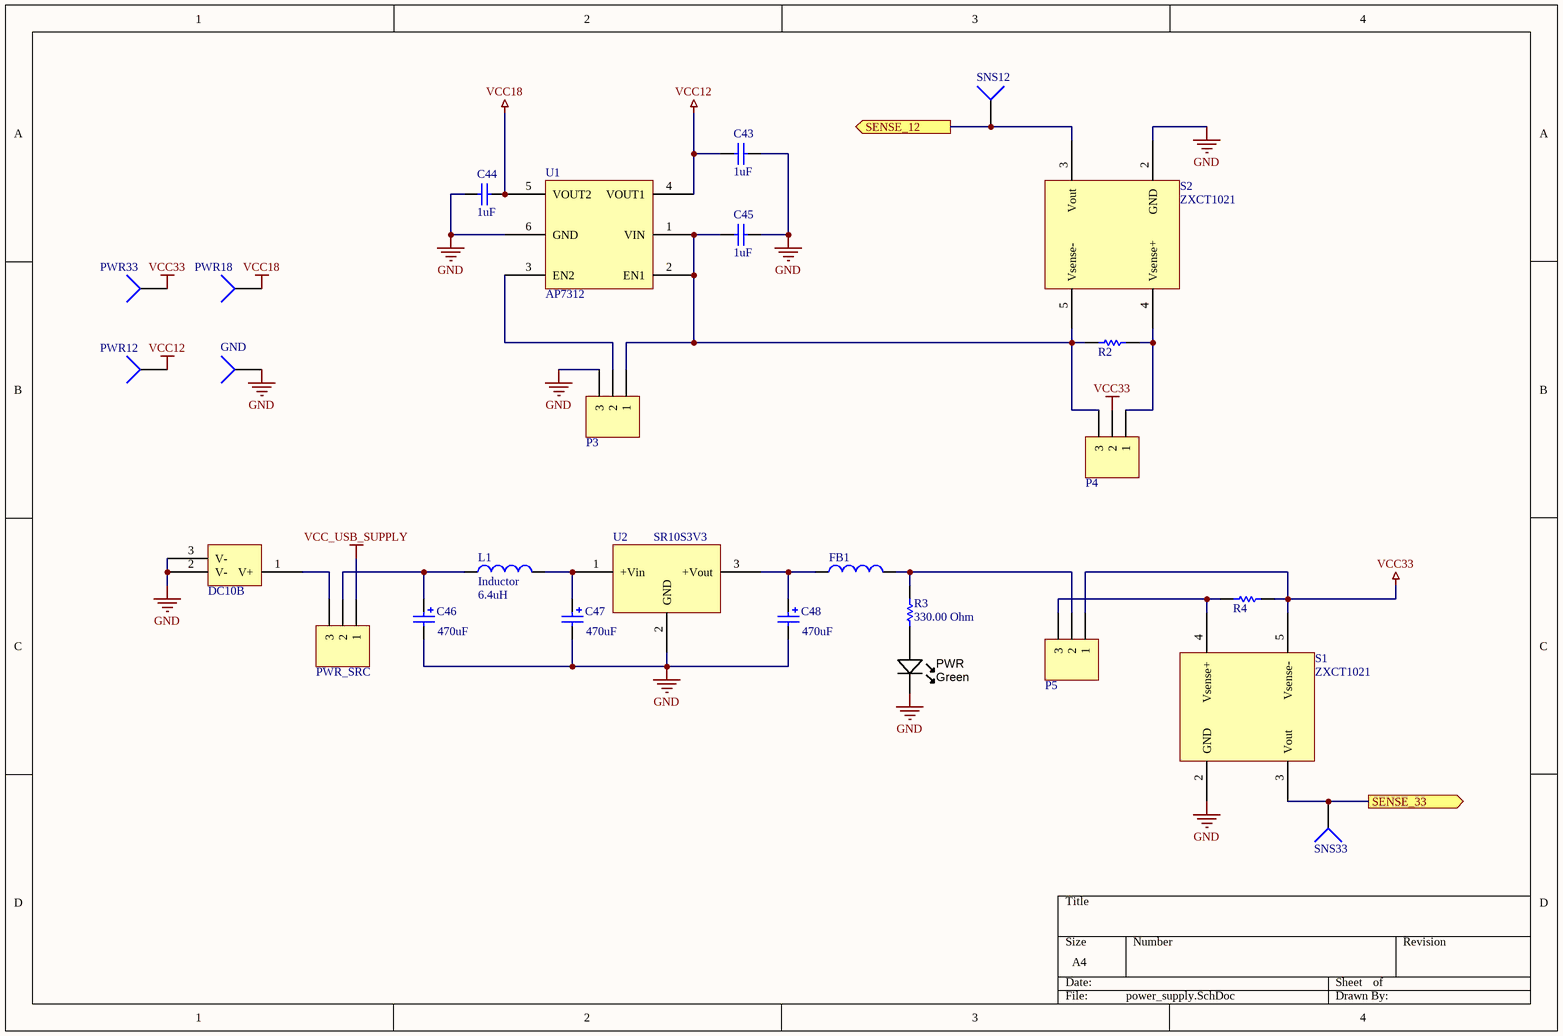
[diagram p7: power_supply.SchDoc]

### Parts
C43  1uF  [CAPC0805(2012)100_N]
C44  1uF  [CAPC0805(2012)100_N]
C45  1uF  [CAPC0805(2012)100_N]
C46  value 470uF  [CAP470uF]  (hidden comment: Cap Pol2)
C47  value 470uF  [CAP470uF]  (hidden comment: Cap Pol2)
C48  value 470uF  [CAP470uF]  (hidden comment: Cap Pol2)
FB1  Inductor  [INDC3216]  (value not drawn)
GND  Socket  [PIN1]  (value not drawn)
L1  Inductor  value 6.4uH  [Coil DRA74-6R8-R]
P3  Header 3  [HDR1X3]  (value not drawn)
P4  Header 3  [HDR1X3]  (value not drawn)
P5  Header 3  [HDR1X3]  (value not drawn)
PWR  Green  [LED-0805-K]
PWR12  Socket  [PIN1]  (value not drawn)
PWR18  Socket  [PIN1]  (value not drawn)
PWR33  Socket  [PIN1]  (value not drawn)
PWR_SRC  Header 3  [HDR1X3]  (value not drawn)
PWRCON  DC10B  [DC-10B]
R2  10R 5% 0805(2012)  [RESC0805(2012)_L]  (value not drawn)
R3  330.00 Ohm  [RESC0805(2012)_M]
R4  10R 5% 0805(2012)  [RESC0805(2012)_L]  (value not drawn)
S1  ZXCT1021  [SOT95P270X145-5N]
S2  ZXCT1021  [SOT95P270X145-5N]
SNS12  Socket  [PIN1]  (value not drawn)
SNS33  Socket  [PIN1]  (value not drawn)
U1  AP7312  [SOT95P285X145-6N]
U2  SR10S3V3  [SR10S3V3_Footprint]

### Ports
SENSE_12 (out), SENSE_33 (out)

### Nets
GND: C43.2 C44.1 C45.2 C46.2 C47.2 C48.2 GND.1 P3.3 PWR.K PWRCON.2(V-) PWRCON.3(V-) S1.2(GND) S2.2(GND) U1.6(GND) U2.2(GND)
VCC12: C43.1 PWR12.1 U1.4(VOUT1)
VCC18: C44.2 PWR18.1 U1.5(VOUT2)
VCC33: P4.2 P5.1 PWR33.1 R4.2 S1.5(Vsense-)
VCC_USB_SUPPLY: PWR_SRC.1
NetC45_1: C45.1 P3.1 P4.3 R2.1 S2.5(Vsense-) U1.1(VIN) U1.2(EN1)
NetC46_1: C46.1 L1.1 PWR_SRC.2
NetC47_1: C47.1 L1.2 U2.1(+Vin)
NetC48_1: C48.1 FB1.1 U2.3(+Vout)
NetFB1_2: FB1.2 P5.2 R3.2
NetGG_H9: S2.3(Vout) SNS12.1 ; port SENSE_12
NetGG_J11: S1.3(Vout) SNS33.1 ; port SENSE_33
NetP3_2: P3.2 U1.3(EN2)
NetP4_1: P4.1 R2.2 S2.4(Vsense+)
NetP5_3: P5.3 R4.1 S1.4(Vsense+)
NetPWR_A: PWR.A R3.1
NetPWR_SRC_3: PWR_SRC.3 PWRCON.1(V+)

### Library data of the parts
C43-C45 = CMP-1036-04747-1: as C1 on sheet arm_sheet; Tolerance: ±10%; Technology: SMT; Value: 1uF; Rated Voltage: 16 V; Max Thickness: 1 mm
C46-C48 = Cap Pol2: Polarized Capacitor (Axial); Published: 8-Jun-2000; LatestRevisionDate: 17-Jul-2002; LatestRevisionNote: Re-released for DXP Platform.; PackageReference: POLAR0.8; Publisher: Altium Limited; PackageDescription: Polarized Capacitor; 2 Leads
FB1 = Inductor: Value: 10mH; Code_IEC: 1005; Published: 8-Jun-2000; LatestRevisionDate: 29-May-2009; LatestRevisionNote: IPC-7351 Footprint Added.; PackageReference: 0402-A; Publisher: Altium Limited; PackageDescription: Chip Inductor; Code_JEITA: 0402
L1 = Inductor: Code_IEC: 1005; Published: 8-Jun-2000; LatestRevisionDate: 29-May-2009; LatestRevisionNote: IPC-7351 Footprint Added.; PackageReference: 0402-A; Publisher: Altium Limited; PackageDescription: Chip Inductor; Code_JEITA: 0402
P3-P5 PWR_SRC = Header 3: Header, 3-Pin; LatestRevisionDate: 17-Jul-2002; LatestRevisionNote: Re-released for DXP Platform.; Publisher: Altium Limited
PWR = LED_SMD_Green_0805: LED, 0805 SMD, Green; Manufacturer 1: Ligitek; Manufacturer Part Number 1: LG170G-CT; Ratings: 10 mcd; 573 nm; Package / Case: 0805; Material: GaP
R2 R4 = CMP-1013-00026-1: 10R 0.125W 5% 0805 (2012 Metric)  SMD; Value: 10.00 Ohm; Case-EIA: 0805; Case-Metric: 2012; Technology: SMT; Power: 0.125 W; Tolerance: 5 %
R3 = CMP-1013-00454-1: as R5 on sheet uart_usb_bridge; Value: 330.00 Ohm; Power: 0.125 W; Tolerance: 1 %; Technology: SMT
GND PWR12 PWR18 PWR33 SNS12 SNS33 = Socket: LatestRevisionDate: 17-Jul-2002; LatestRevisionNote: Re-released for DXP Platform.; Publisher: Altium Limited

## Sheet fpga_sheet.SchDoc
size A4
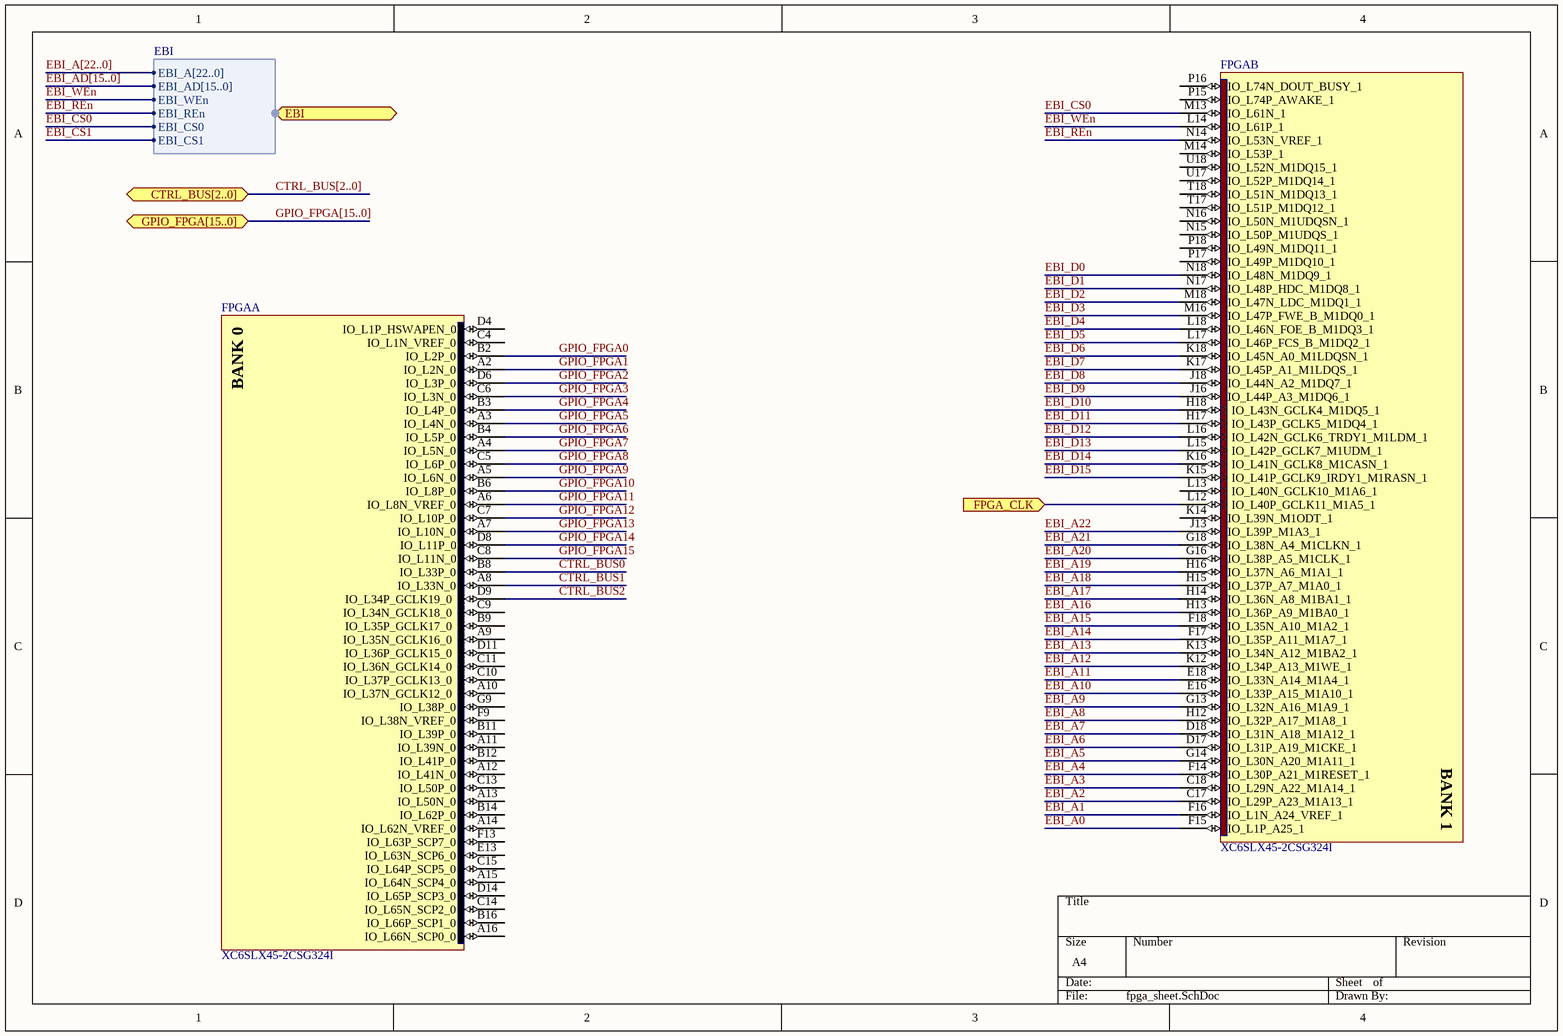
[diagram p8: fpga_sheet.SchDoc]

### Parts
FPGA  XC6SLX45-2CSG324I  [CSG324]  (parts A,B of 8)

### Ports
CTRL_BUS[2..0] (bidir), EBI (harness EBI), FPGA_CLK (in), GPIO_FPGA[15..0] (bidir)

### Harnesses
EBI: EBI_A[22..0], EBI_AD[15..0], EBI_WEn, EBI_REn, EBI_CS0, EBI_CS1

### Nets
CTRL_BUS0: FPGA.B8(IO_L33P_0)
CTRL_BUS1: FPGA.A8(IO_L33N_0)
CTRL_BUS2: FPGA.D9(IO_L34P_GCLK19_0)
EBI_A0: FPGA.F15(IO_L1P_A25_1)
EBI_A1: FPGA.F16(IO_L1N_A24_VREF_1)
EBI_A2: FPGA.C17(IO_L29P_A23_M1A13_1)
EBI_A3: FPGA.C18(IO_L29N_A22_M1A14_1)
EBI_A4: FPGA.F14(IO_L30P_A21_M1RESET_1)
EBI_A5: FPGA.G14(IO_L30N_A20_M1A11_1)
EBI_A6: FPGA.D17(IO_L31P_A19_M1CKE_1)
EBI_A7: FPGA.D18(IO_L31N_A18_M1A12_1)
EBI_A8: FPGA.H12(IO_L32P_A17_M1A8_1)
EBI_A9: FPGA.G13(IO_L32N_A16_M1A9_1)
EBI_A10: FPGA.E16(IO_L33P_A15_M1A10_1)
EBI_A11: FPGA.E18(IO_L33N_A14_M1A4_1)
EBI_A12: FPGA.K12(IO_L34P_A13_M1WE_1)
EBI_A13: FPGA.K13(IO_L34N_A12_M1BA2_1)
EBI_A14: FPGA.F17(IO_L35P_A11_M1A7_1)
EBI_A15: FPGA.F18(IO_L35N_A10_M1A2_1)
EBI_A16: FPGA.H13(IO_L36P_A9_M1BA0_1)
EBI_A17: FPGA.H14(IO_L36N_A8_M1BA1_1)
EBI_A18: FPGA.H15(IO_L37P_A7_M1A0_1)
EBI_A19: FPGA.H16(IO_L37N_A6_M1A1_1)
EBI_A20: FPGA.G16(IO_L38P_A5_M1CLK_1)
EBI_A21: FPGA.G18(IO_L38N_A4_M1CLKN_1)
EBI_A22: FPGA.J13(IO_L39P_M1A3_1)
EBI_CS0: FPGA.M13(IO_L61N_1) ; port EBI.EBI_CS0
EBI_D0: FPGA.N18(IO_L48N_M1DQ9_1)
EBI_D1: FPGA.N17(IO_L48P_HDC_M1DQ8_1)
EBI_D2: FPGA.M18(IO_L47N_LDC_M1DQ1_1)
EBI_D3: FPGA.M16(IO_L47P_FWE_B_M1DQ0_1)
EBI_D4: FPGA.L18(IO_L46N_FOE_B_M1DQ3_1)
EBI_D5: FPGA.L17(IO_L46P_FCS_B_M1DQ2_1)
EBI_D6: FPGA.K18(IO_L45N_A0_M1LDQSN_1)
EBI_D7: FPGA.K17(IO_L45P_A1_M1LDQS_1)
EBI_D8: FPGA.J18(IO_L44N_A2_M1DQ7_1)
EBI_D9: FPGA.J16(IO_L44P_A3_M1DQ6_1)
EBI_D10: FPGA.H18(IO_L43N_GCLK4_M1DQ5_1)
EBI_D11: FPGA.H17(IO_L43P_GCLK5_M1DQ4_1)
EBI_D12: FPGA.L16(IO_L42N_GCLK6_TRDY1_M1LDM_1)
EBI_D13: FPGA.L15(IO_L42P_GCLK7_M1UDM_1)
EBI_D14: FPGA.K16(IO_L41N_GCLK8_M1CASN_1)
EBI_D15: FPGA.K15(IO_L41P_GCLK9_IRDY1_M1RASN_1)
EBI_REn: FPGA.N14(IO_L53N_VREF_1) ; port EBI.EBI_REn
EBI_WEn: FPGA.L14(IO_L61P_1) ; port EBI.EBI_WEn
GPIO_FPGA0: FPGA.B2(IO_L2P_0)
GPIO_FPGA1: FPGA.A2(IO_L2N_0)
GPIO_FPGA2: FPGA.D6(IO_L3P_0)
GPIO_FPGA3: FPGA.C6(IO_L3N_0)
GPIO_FPGA4: FPGA.B3(IO_L4P_0)
GPIO_FPGA5: FPGA.A3(IO_L4N_0)
GPIO_FPGA6: FPGA.B4(IO_L5P_0)
GPIO_FPGA7: FPGA.A4(IO_L5N_0)
GPIO_FPGA8: FPGA.C5(IO_L6P_0)
GPIO_FPGA9: FPGA.A5(IO_L6N_0)
GPIO_FPGA10: FPGA.B6(IO_L8P_0)
GPIO_FPGA11: FPGA.A6(IO_L8N_VREF_0)
GPIO_FPGA12: FPGA.C7(IO_L10P_0)
GPIO_FPGA13: FPGA.A7(IO_L10N_0)
GPIO_FPGA14: FPGA.D8(IO_L11P_0)
GPIO_FPGA15: FPGA.C8(IO_L11N_0)
NetCG1_3: FPGA.L12(IO_L40P_GCLK11_M1A5_1) ; port FPGA_CLK

Not connected (* = marked no-connect by the designer): FPGA A9(IO_L35N_GCLK16_0) A10(IO_L37N_GCLK12_0) A11(IO_L39N_0) A12(IO_L41N_0) A13(IO_L50N_0) A14(IO_L62N_VREF_0) A15(IO_L64N_SCP4_0) A16(IO_L66N_SCP0_0) B9(IO_L35P_GCLK17_0) B11(IO_L39P_0) B12(IO_L41P_0) B14(IO_L62P_0) B16(IO_L66P_SCP1_0) C4(IO_L1N_VREF_0) C9(IO_L34N_GCLK18_0) C10(IO_L37P_GCLK13_0) C11(IO_L36N_GCLK14_0) C13(IO_L50P_0) C14(IO_L65N_SCP2_0) C15(IO_L64P_SCP5_0) D4(IO_L1P_HSWAPEN_0) D11(IO_L36P_GCLK15_0) D14(IO_L65P_SCP3_0) E13(IO_L63N_SCP6_0) F9(IO_L38N_VREF_0) F13(IO_L63P_SCP7_0) G9(IO_L38P_0) K14(IO_L39N_M1ODT_1) L13(IO_L40N_GCLK10_M1A6_1) M14(IO_L53P_1) N15(IO_L50P_M1UDQS_1) N16(IO_L50N_M1UDQSN_1) P15(IO_L74P_AWAKE_1) P16(IO_L74N_DOUT_BUSY_1) P17(IO_L49P_M1DQ10_1) P18(IO_L49N_M1DQ11_1) T17(IO_L51P_M1DQ12_1) T18(IO_L51N_M1DQ13_1) U17(IO_L52P_M1DQ14_1) U18(IO_L52N_M1DQ15_1)

### Buses and harness runs
bus CTRL_BUS[2..0] = port CTRL_BUS[2..0]
bus EBI_A[22..0]
bus EBI_AD[15..0]
bus GPIO_FPGA[15..0] = port GPIO_FPGA[15..0]

### Notes on the sheet
- (in symbol XC6SLX45-2CSG324I, part A) BANK 0
- (in symbol XC6SLX45-2CSG324I, part B) BANK 1

### Library data of the parts
FPGA = XC6SLX45-2CSG324I: as FPGA on sheet fpga_power; DatasheetVersion: ver1.6, Nov-2010; PackageVersion: ver1.1, Nov-2009; PackageReference: CSG324; PackageDescription: 324-Ball Chip-Scale BGA (CSG324) Package, 0.8 mm Pitch; Code_JEDEC: MO-275-KKAC-1; ComponentLink1Description: Manufacturer URL; ComponentLink1URL: http://www.xilinx.com/; ComponentLink2Description: Spartan-6 Datasheet; ComponentLink2URL: http://www.xilinx.com/support/documentation/data_sheets/ds160.pdf; ComponentLink3Description: Spartan-6 Documents; ComponentLink3URL: http://www.xilinx.com/support/documentation/spartan-6.htm

## Sheet fpga_flash_debug.SchDoc
size A4
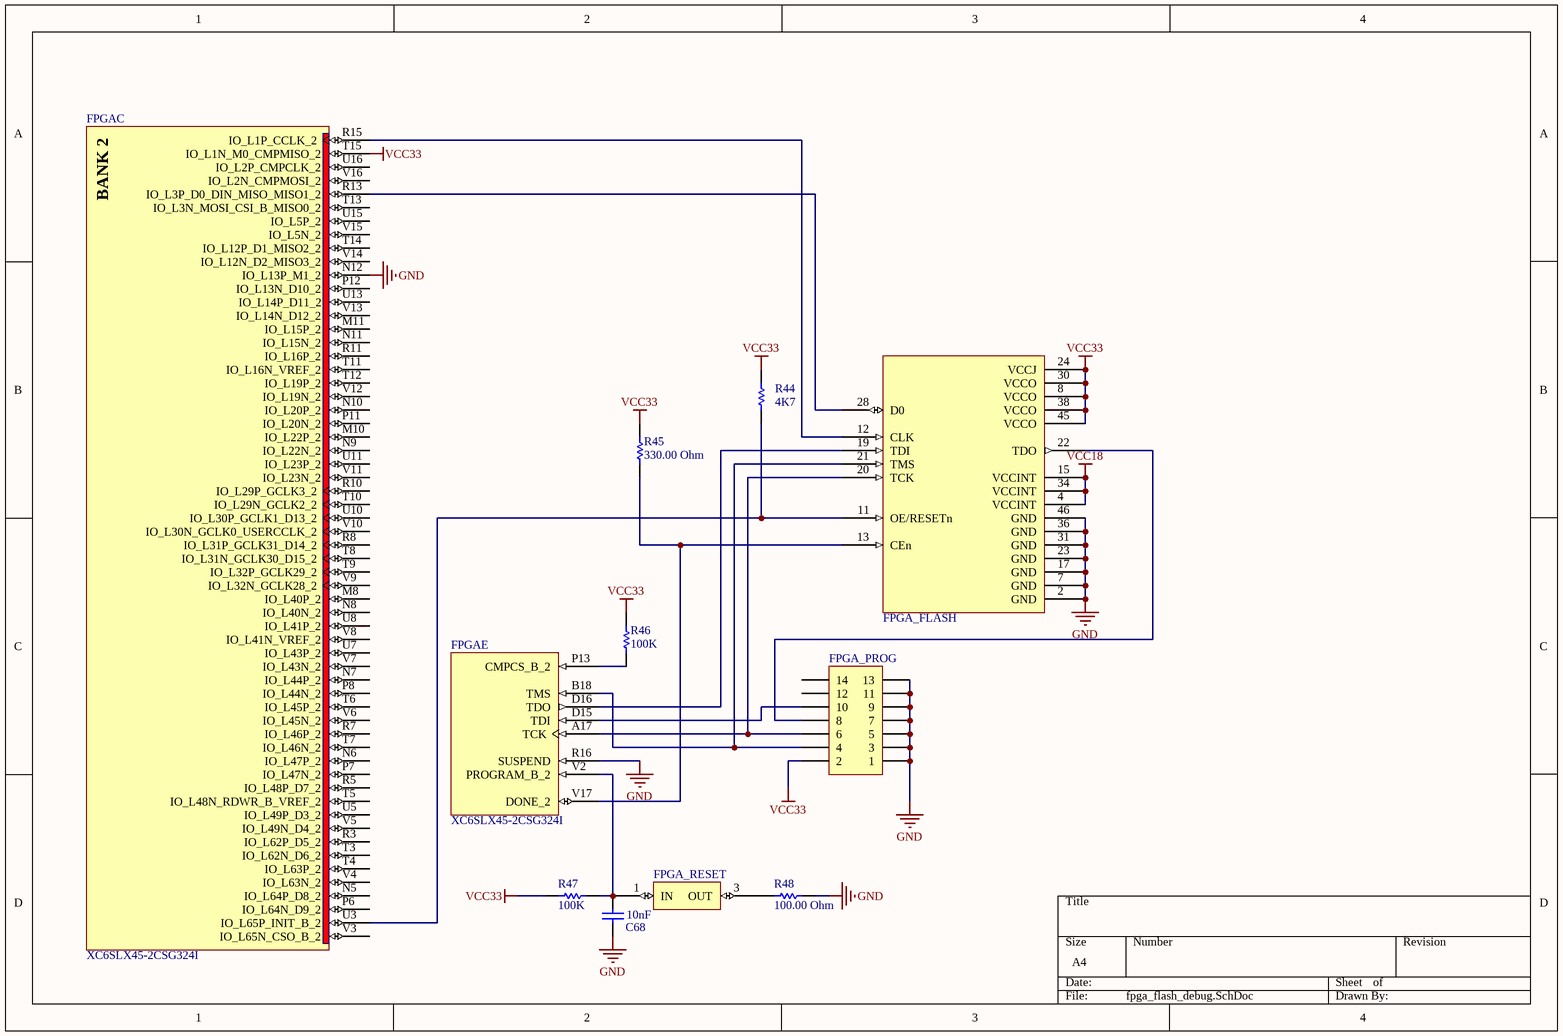
[diagram p9: fpga_flash_debug.SchDoc]

### Parts
C68  10nF  [CAPC0805(2012)75_N]
FPGA  XC6SLX45-2CSG324I  [CSG324]  (parts C,E of 8)
FPGA_FLASH  XCF16PVOG48C  [FPGA_FLASH]  (value not drawn)
FPGA_PROG  Header 7X2  [HDR2X7]  (value not drawn)
FPGA_RESET  BUTTON  [BUTTON]  (value not drawn)
R44  4K7  [RESC0805(2012)_M]
R45  330.00 Ohm  [RESC0805(2012)_M]
R46  100K  [RESC0805(2012)_L]
R47  100K  [RESC0805(2012)_L]
R48  100.00 Ohm  [RESC0805(2012)_M]

### Nets
GND: C68.1 FPGA.N12(IO_L13P_M1_2) FPGA.R16(SUSPEND) FPGA_FLASH.2(GND) FPGA_FLASH.7(GND) FPGA_FLASH.17(GND) FPGA_FLASH.23(GND) FPGA_FLASH.31(GND) FPGA_FLASH.36(GND) FPGA_FLASH.46(GND) FPGA_PROG.1 FPGA_PROG.3 FPGA_PROG.5 FPGA_PROG.7 FPGA_PROG.9 FPGA_PROG.11 FPGA_PROG.13 R48.2
VCC18: FPGA_FLASH.4(VCCINT) FPGA_FLASH.15(VCCINT) FPGA_FLASH.34(VCCINT)
VCC33: FPGA.T15(IO_L1N_M0_CMPMISO_2) FPGA_FLASH.8(VCCO) FPGA_FLASH.24(VCCJ) FPGA_FLASH.30(VCCO) FPGA_FLASH.38(VCCO) FPGA_FLASH.45(VCCO) FPGA_PROG.2 R44.1 R45.1 R46.2 R47.2
NetC68_2: C68.2 FPGA.V2(PROGRAM_B_2) FPGA_RESET.1(IN) R47.1
NetFPGA_A17: FPGA.A17(TCK) FPGA_FLASH.20(TCK) FPGA_PROG.6
NetFPGA_B18: FPGA.B18(TMS) FPGA_FLASH.21(TMS) FPGA_PROG.4
NetFPGA_D15: FPGA.D15(TDI) FPGA_PROG.10
NetFPGA_D16: FPGA.D16(TDO) FPGA_FLASH.19(TDI)
NetFPGA_FLASH_22: FPGA_FLASH.22(TDO) FPGA_PROG.8
NetFPGA_P13: FPGA.P13(CMPCS_B_2) R46.1
NetFPGA_R13: FPGA.R13(IO_L3P_D0_DIN_MISO_MISO1_2) FPGA_FLASH.28(D0)
NetFPGA_R15: FPGA.R15(IO_L1P_CCLK_2) FPGA_FLASH.12(CLK)
NetFPGA_RESET_3: FPGA_RESET.3(OUT) R48.1
NetFPGA_U3: FPGA.U3(IO_L65P_INIT_B_2) FPGA_FLASH.11(OE/RESETn) R44.2
NetFPGA_V17: FPGA.V17(DONE_2) FPGA_FLASH.13(CEn) R45.2

Not connected (* = marked no-connect by the designer): FPGA M8(IO_L40P_2) M10(IO_L22P_2) M11(IO_L15P_2) N5(IO_L64P_D8_2) N6(IO_L47P_2) N7(IO_L44P_2) N8(IO_L40N_2) N9(IO_L22N_2) N10(IO_L20P_2) N11(IO_L15N_2) P6(IO_L64N_D9_2) P7(IO_L47N_2) P8(IO_L44N_2) P11(IO_L20N_2) P12(IO_L13N_D10_2) R3(IO_L62P_D5_2) R5(IO_L48P_D7_2) R7(IO_L46P_2) R8(IO_L31P_GCLK31_D14_2) R10(IO_L29P_GCLK3_2) R11(IO_L16P_2) T3(IO_L62N_D6_2) T4(IO_L63P_2) T5(IO_L48N_RDWR_B_VREF_2) T6(IO_L45P_2) T7(IO_L46N_2) T8(IO_L31N_GCLK30_D15_2) T9(IO_L32P_GCLK29_2) T10(IO_L29N_GCLK2_2) T11(IO_L16N_VREF_2) T12(IO_L19P_2) T13(IO_L3N_MOSI_CSI_B_MISO0_2) T14(IO_L12P_D1_MISO2_2) U5(IO_L49P_D3_2) U7(IO_L43P_2) U8(IO_L41P_2) U10(IO_L30P_GCLK1_D13_2) U11(IO_L23P_2) U13(IO_L14P_D11_2) U15(IO_L5P_2) U16(IO_L2P_CMPCLK_2) V3(IO_L65N_CSO_B_2) V4(IO_L63N_2) V5(IO_L49N_D4_2) V6(IO_L45N_2) V7(IO_L43N_2) V8(IO_L41N_VREF_2) V9(IO_L32N_GCLK28_2) V10(IO_L30N_GCLK0_USERCCLK_2) V11(IO_L23N_2) V12(IO_L19N_2) V13(IO_L14N_D12_2) V14(IO_L12N_D2_MISO3_2) V15(IO_L5N_2) V16(IO_L2N_CMPMOSI_2); FPGA_PROG 12 14

### Notes on the sheet
- (in symbol XC6SLX45-2CSG324I, part C) BANK 2

### Library data of the parts
C68 = CMP-1036-03842-1: as C28 on sheet arm_power; Value: 10nF; Max Thickness: 0.75 mm; Rated Voltage: 50 V; Tolerance: ±10%; Technology: SMT
FPGA = XC6SLX45-2CSG324I: as FPGA on sheet fpga_power; DatasheetVersion: ver1.6, Nov-2010; PackageVersion: ver1.1, Nov-2009; PackageReference: CSG324; PackageDescription: 324-Ball Chip-Scale BGA (CSG324) Package, 0.8 mm Pitch; Code_JEDEC: MO-275-KKAC-1; ComponentLink1Description: Manufacturer URL; ComponentLink1URL: http://www.xilinx.com/; ComponentLink2Description: Spartan-6 Datasheet; ComponentLink2URL: http://www.xilinx.com/support/documentation/data_sheets/ds160.pdf; ComponentLink3Description: Spartan-6 Documents; ComponentLink3URL: http://www.xilinx.com/support/documentation/spartan-6.htm
FPGA_PROG = Header 7X2: Header, 7-Pin, Dual row; LatestRevisionDate: 17-Jul-2002; LatestRevisionNote: Re-released for DXP Platform.; Publisher: Altium Limited
R44 = CMP-1013-00586-1: 4K7 0.125W 1% 0805 (2012 Metric)  SMD; Value: 4700.00 Ohm; Case-EIA: 0805; Case-Metric: 2012; Power: 0.125 W; Tolerance: 1 %; Technology: SMT
R45 = CMP-1013-00454-1: as R5 on sheet uart_usb_bridge; Value: 330.00 Ohm; Power: 0.125 W; Tolerance: 1 %; Technology: SMT
R46 R47 = CMP-1013-00122-1: as R7 on sheet uart_usb_bridge; Tolerance: 5 %; Technology: SMT; Power: 0.125 W
R48 = CMP-1013-00050-1: as R8 on sheet uart_usb_bridge; Tolerance: 5 %; Power: 0.125 W; Technology: SMT; Value: 100.00 Ohm

## Sheet audio_interface.SchDoc
size A4
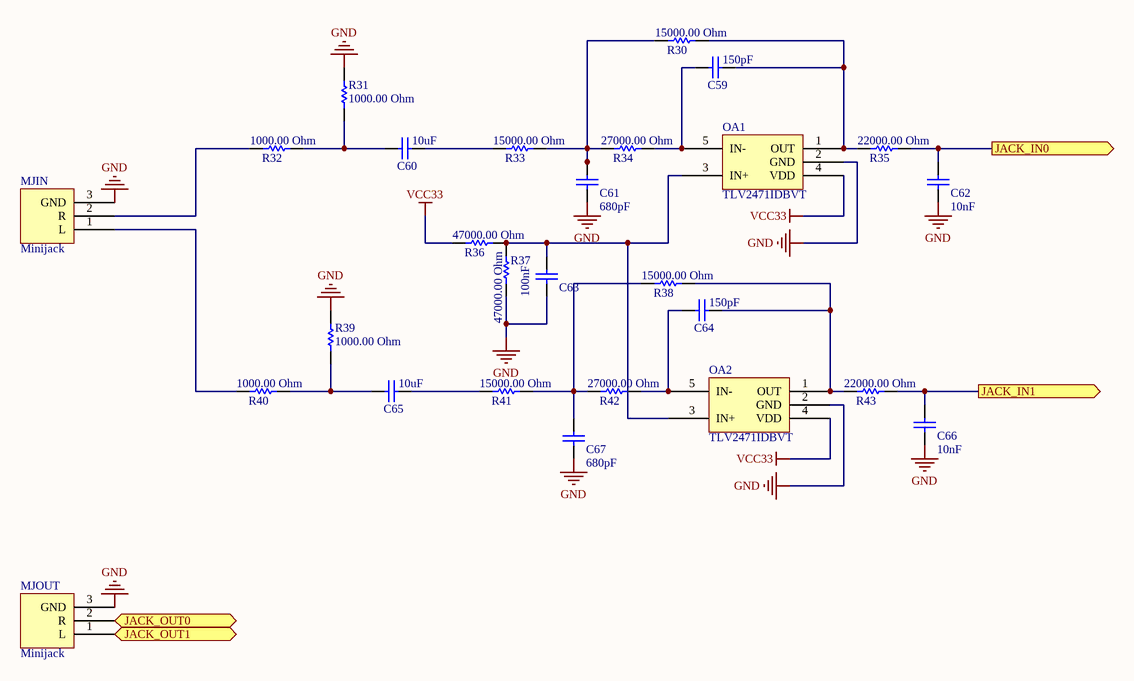
[diagram p10: audio_interface.SchDoc]

### Parts
C59  150pF  [CAPC0805(2012)75_M]
C60  10uF  [CAPC0805(2012)145_L]
C61  680pF  [CAPC0805(2012)100_M]
C62  10nF  [CAPC0805(2012)100_M]
C63  100nF  [CAPC0805(2012)100_M]
C64  150pF  [CAPC0805(2012)75_M]
C65  10uF  [CAPC0805(2012)145_L]
C66  10nF  [CAPC0805(2012)100_M]
C67  680pF  [CAPC0805(2012)100_M]
MJIN  Minijack  [MINIJACKS]
MJOUT  Minijack  [MINIJACKS]
OA1  TLV2471IDBVT  [TLV2471IDBVT]
OA2  TLV2471IDBVT  [TLV2471IDBVT]
R30  15000.00 Ohm  [RESC0805(2012)_M]
R31  1000.00 Ohm  [RESC0805(2012)_M]
R32  1000.00 Ohm  [RESC0805(2012)_M]
R33  15000.00 Ohm  [RESC0805(2012)_M]
R34  27000.00 Ohm  [RESC0805(2012)_M]
R35  22000.00 Ohm  [RESC0805(2012)_M]
R36  47000.00 Ohm  [RESC0805(2012)_M]
R37  47000.00 Ohm  [RESC0805(2012)_M]
R38  15000.00 Ohm  [RESC0805(2012)_M]
R39  1000.00 Ohm  [RESC0805(2012)_M]
R40  1000.00 Ohm  [RESC0805(2012)_M]
R41  15000.00 Ohm  [RESC0805(2012)_M]
R42  27000.00 Ohm  [RESC0805(2012)_M]
R43  22000.00 Ohm  [RESC0805(2012)_M]

### Ports
JACK_IN0 (out), JACK_IN1 (out), JACK_OUT0 (in), JACK_OUT1 (in)

### Nets
GND: C61.2 C62.2 C63.2 C66.2 C67.2 MJIN.3(GND) MJOUT.3(GND) OA1.2(GND) OA2.2(GND) R31.1 R37.2 R39.1
VCC33: OA1.4(VDD) OA2.4(VDD) R36.2
NetC59_1: C59.1 OA1.1(OUT) R30.1 R35.2
NetC59_2: C59.2 OA1.5(IN-) R34.1
NetC60_1: C60.1 R33.2
NetC60_2: C60.2 R31.2 R32.1
NetC61_1: C61.1 R30.2 R33.1 R34.2
NetC62_1: C62.1 R35.1 ; port JACK_IN0
NetC63_1: C63.1 OA1.3(IN+) OA2.3(IN+) R36.1 R37.1
NetC64_1: C64.1 OA2.1(OUT) R38.1 R43.2
NetC64_2: C64.2 OA2.5(IN-) R42.1
NetC65_1: C65.1 R41.2
NetC65_2: C65.2 R39.2 R40.1
NetC66_1: C66.1 R43.1 ; port JACK_IN1
NetC67_1: C67.1 R38.2 R41.1 R42.2
NetGG_L5: MJOUT.2(R) ; port JACK_OUT0
NetGG_L6: MJOUT.1(L) ; port JACK_OUT1
NetMJIN_1: MJIN.1(L) R40.2
NetMJIN_2: MJIN.2(R) R32.2

### Library data of the parts
C59 C64 = CMP-1036-02142-1: CAP 150pF 100V ±1% 0805 (2012 Metric) Thickness 0.75mm SMD; Case-Metric: 2012; Case-EIA: 0805; Rated Voltage: 100 V; Max Thickness: 0.75 mm; Tolerance: ±1%; Value: 150pF; Technology: SMT
C60 C65 = CMP-1036-04915-1: CAP 10uF 6.3V ±10% 0805 (2012 Metric) Thickness 1.45mm SMD; Case-Metric: 2012; Case-EIA: 0805; Rated Voltage: 6.3 V; Max Thickness: 1.45 mm; Tolerance: ±10%; Value: 10uF; Technology: SMT
C61 C67 = CMP-1036-02797-1: CAP 680pF 6.3V ±5% 0805 (2012 Metric) Thickness 1mm SMD; Case-Metric: 2012; Case-EIA: 0805; Rated Voltage: 6.3 V; Max Thickness: 1 mm; Tolerance: ±5%; Value: 680pF; Technology: SMT
C62 C66 = CMP-1036-03801-1: CAP 10nF 6.3V ±5% 0805 (2012 Metric) Thickness 1mm SMD; Case-Metric: 2012; Case-EIA: 0805; Rated Voltage: 6.3 V; Max Thickness: 1 mm; Tolerance: ±5%; Value: 10nF; Technology: SMT
C63 = CMP-1036-04390-1: CAP 100nF 6.3V ±5% 0805 (2012 Metric) Thickness 1mm SMD; Case-Metric: 2012; Case-EIA: 0805; Rated Voltage: 6.3 V; Max Thickness: 1 mm; Tolerance: ±5%; Value: 100nF; Technology: SMT
R30 R33 R38 R41 = CMP-1013-00641-1: 15K 0.125W 1% 0805 (2012 Metric)  SMD; Case-EIA: 0805; Case-Metric: 2012; Value: 15000.00 Ohm; Power: 0.125 W; Tolerance: 1 %; Technology: SMT
R31 R32 R39 R40 = CMP-1013-00510-1: 1K 0.125W 1% 0805 (2012 Metric)  SMD; Case-EIA: 0805; Case-Metric: 2012; Value: 1000.00 Ohm; Power: 0.125 W; Tolerance: 1 %; Technology: SMT
R34 R42 = CMP-1013-00670-1: 27K 0.125W 1% 0805 (2012 Metric)  SMD; Case-EIA: 0805; Case-Metric: 2012; Value: 27000.00 Ohm; Power: 0.125 W; Tolerance: 1 %; Technology: SMT
R35 R43 = CMP-1013-00659-1: 22K 0.125W 1% 0805 (2012 Metric)  SMD; Case-EIA: 0805; Case-Metric: 2012; Value: 22000.00 Ohm; Power: 0.125 W; Tolerance: 1 %; Technology: SMT
R36 R37 = CMP-1013-00699-1: 47K 0.125W 1% 0805 (2012 Metric)  SMD; Case-EIA: 0805; Case-Metric: 2012; Value: 47000.00 Ohm; Power: 0.125 W; Tolerance: 1 %; Technology: SMT

## Sheet sram.SchDoc
size A4
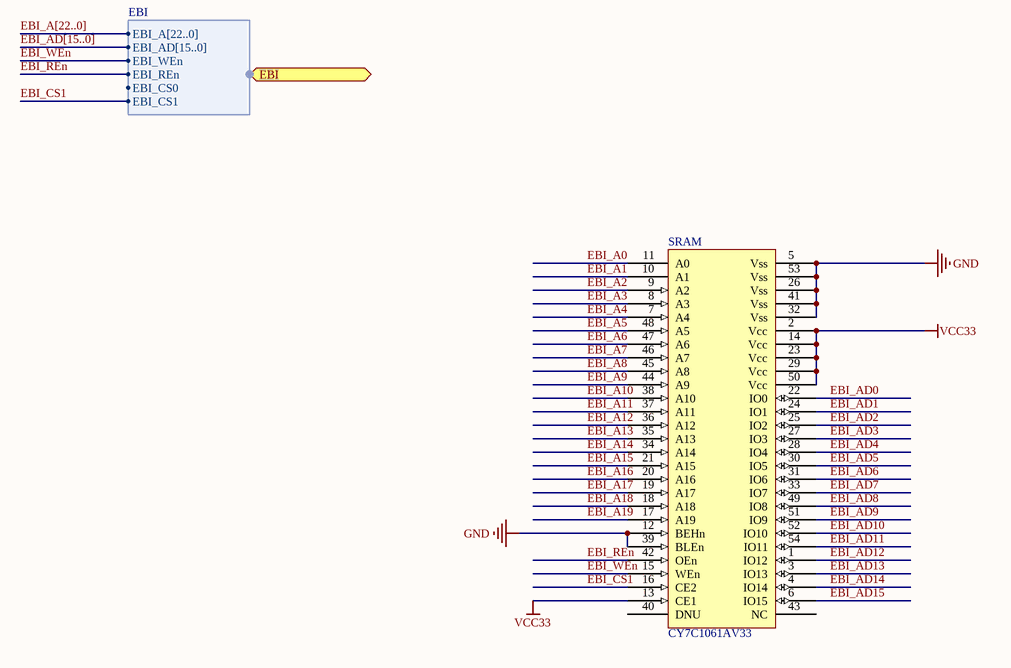
[diagram p11: sram.SchDoc]

### Parts
SRAM  CY7C1061AV33  [CY7C1061AV33]

### Ports
EBI (harness EBI)

### Harnesses
EBI: EBI_A[22..0], EBI_AD[15..0], EBI_WEn, EBI_REn, EBI_CS0, EBI_CS1

### Nets
GND: SRAM.5(Vss) SRAM.12(BEHn) SRAM.26(Vss) SRAM.32(Vss) SRAM.39(BLEn) SRAM.41(Vss) SRAM.53(Vss)
VCC33: SRAM.2(Vcc) SRAM.13(CE1) SRAM.14(Vcc) SRAM.23(Vcc) SRAM.29(Vcc) SRAM.50(Vcc)
EBI_A0: SRAM.11(A0)
EBI_A1: SRAM.10(A1)
EBI_A2: SRAM.9(A2)
EBI_A3: SRAM.8(A3)
EBI_A4: SRAM.7(A4)
EBI_A5: SRAM.48(A5)
EBI_A6: SRAM.47(A6)
EBI_A7: SRAM.46(A7)
EBI_A8: SRAM.45(A8)
EBI_A9: SRAM.44(A9)
EBI_A10: SRAM.38(A10)
EBI_A11: SRAM.37(A11)
EBI_A12: SRAM.36(A12)
EBI_A13: SRAM.35(A13)
EBI_A14: SRAM.34(A14)
EBI_A15: SRAM.21(A15)
EBI_A16: SRAM.20(A16)
EBI_A17: SRAM.19(A17)
EBI_A18: SRAM.18(A18)
EBI_A19: SRAM.17(A19)
EBI_AD0: SRAM.22(IO0)
EBI_AD1: SRAM.24(IO1)
EBI_AD2: SRAM.25(IO2)
EBI_AD3: SRAM.27(IO3)
EBI_AD4: SRAM.28(IO4)
EBI_AD5: SRAM.30(IO5)
EBI_AD6: SRAM.31(IO6)
EBI_AD7: SRAM.33(IO7)
EBI_AD8: SRAM.49(IO8)
EBI_AD9: SRAM.51(IO9)
EBI_AD10: SRAM.52(IO10)
EBI_AD11: SRAM.54(IO11)
EBI_AD12: SRAM.1(IO12)
EBI_AD13: SRAM.3(IO13)
EBI_AD14: SRAM.4(IO14)
EBI_AD15: SRAM.6(IO15)
EBI_CS1: SRAM.16(CE2) ; port EBI.EBI_CS1
EBI_REn: SRAM.42(OEn) ; port EBI.EBI_REn
EBI_WEn: SRAM.15(WEn) ; port EBI.EBI_WEn

Not connected (* = marked no-connect by the designer): SRAM 40(DNU) 43(NC)

### Buses and harness runs
bus EBI_A[22..0]
bus EBI_AD[15..0]

## Nets that join several sheets
GND: arm_power (22 pins), arm_sheet (10 pins), fpga_power (62 pins), oscillation (8 pins), uart_usb_bridge (11 pins), user_interface (22 pins), power_supply (15 pins), fpga_flash_debug (18 pins), audio_interface (12 pins), sram (7 pins)
VCC12: fpga_power (11 pins), power_supply (C43.1 PWR12.1 U1.4)
VCC18: power_supply (C44.2 PWR18.1 U1.5), fpga_flash_debug (FPGA_FLASH.4 FPGA_FLASH.15 FPGA_FLASH.34)
VCC33: arm_power (20 pins), arm_sheet (ARM_PROG.1), fpga_power (61 pins), oscillation (CG1.4 FPGA_CLK.3), uart_usb_bridge (LED2.A LED3.A R7.2 U3.4), user_interface (8 pins), power_supply (5 pins), fpga_flash_debug (11 pins), audio_interface (OA1.4 OA2.4 R36.2), sram (6 pins)
VCC_USB_SUPPLY: uart_usb_bridge (C49.2 FB3.2 U3.20), power_supply (PWR_SRC.1)
ARM_HFXTAL_N: arm_sheet (GG.L9), oscillation (C42.1 X2.3)
ARM_HFXTAL_P: arm_sheet (GG.L8), oscillation (C41.1 X2.1)
ARM_LFXTAL_N: arm_sheet (GG.L1), oscillation (C40.2 X1.1)
ARM_LFXTAL_P: arm_sheet (GG.K1), oscillation (C39.2 X1.2)
CTRL_BUS0: arm_sheet (GG.A8), fpga_sheet (FPGA.B8)
CTRL_BUS1: arm_sheet (GG.H1), fpga_sheet (FPGA.A8)
EBI_A0: arm_sheet (GG.J4), fpga_sheet (FPGA.F15), sram (SRAM.11)
EBI_A1: arm_sheet (GG.K3), fpga_sheet (FPGA.F16), sram (SRAM.10)
EBI_A2: arm_sheet (GG.L3), fpga_sheet (FPGA.C17), sram (SRAM.9)
EBI_A3: arm_sheet (GG.J7), fpga_sheet (FPGA.C18), sram (SRAM.8)
EBI_A4: arm_sheet (GG.J8), fpga_sheet (FPGA.F14), sram (SRAM.7)
EBI_A5: arm_sheet (GG.G10), fpga_sheet (FPGA.G14), sram (SRAM.48)
EBI_A6: arm_sheet (GG.G11), fpga_sheet (FPGA.D17), sram (SRAM.47)
EBI_A7: arm_sheet (GG.E9), fpga_sheet (FPGA.D18), sram (SRAM.46)
EBI_A8: arm_sheet (GG.E10), fpga_sheet (FPGA.H12), sram (SRAM.45)
EBI_A9: arm_sheet (GG.D11), fpga_sheet (FPGA.G13), sram (SRAM.44)
EBI_A10: arm_sheet (GG.C10), fpga_sheet (FPGA.E16), sram (SRAM.38)
EBI_A11: arm_sheet (GG.A9), fpga_sheet (FPGA.E18), sram (SRAM.37)
EBI_A12: arm_sheet (GG.B9), fpga_sheet (FPGA.K12), sram (SRAM.36)
EBI_A13: arm_sheet (GG.C9), fpga_sheet (FPGA.K13), sram (SRAM.35)
EBI_A14: arm_sheet (GG.D9), fpga_sheet (FPGA.F17), sram (SRAM.34)
EBI_A15: arm_sheet (GG.D10), fpga_sheet (FPGA.F18), sram (SRAM.21)
EBI_A16: arm_sheet (GG.E4), fpga_sheet (FPGA.H13), sram (SRAM.20)
EBI_A17: arm_sheet (GG.F1), fpga_sheet (FPGA.H14), sram (SRAM.19)
EBI_A18: arm_sheet (GG.F2), fpga_sheet (FPGA.H15), sram (SRAM.18)
EBI_A19: arm_sheet (GG.F3), fpga_sheet (FPGA.H16), sram (SRAM.17)
EBI_A20: arm_sheet (GG.F4), fpga_sheet (FPGA.G16)
EBI_A21: arm_sheet (GG.G1), fpga_sheet (FPGA.G18)
EBI_A22: arm_sheet (GG.G2), fpga_sheet (FPGA.J13)
EBI_AD0: arm_sheet (GG.B4), sram (SRAM.22)
EBI_AD1: arm_sheet (GG.A4), sram (SRAM.24)
EBI_AD2: arm_sheet (GG.C3), sram (SRAM.25)
EBI_AD3: arm_sheet (GG.B3), sram (SRAM.27)
EBI_AD4: arm_sheet (GG.A3), sram (SRAM.28)
EBI_AD5: arm_sheet (GG.B2), sram (SRAM.30)
EBI_AD6: arm_sheet (GG.A2), sram (SRAM.31)
EBI_AD7: arm_sheet (GG.A1), sram (SRAM.33)
EBI_AD8: arm_sheet (GG.B1), sram (SRAM.49)
EBI_AD9: arm_sheet (GG.C2), sram (SRAM.51)
EBI_AD10: arm_sheet (GG.C1), sram (SRAM.52)
EBI_AD11: arm_sheet (GG.D2), sram (SRAM.54)
EBI_AD12: arm_sheet (GG.D1), sram (SRAM.1)
EBI_AD13: arm_sheet (GG.E3), sram (SRAM.3)
EBI_AD14: arm_sheet (GG.E2), sram (SRAM.4)
EBI_AD15: arm_sheet (GG.E1), sram (SRAM.6)
EBI_CS0: arm_sheet (GG.D6), fpga_sheet (FPGA.M13)
EBI_CS1: arm_sheet (GG.A5), sram (SRAM.16)
EBI_REn: arm_sheet (GG.C6), fpga_sheet (FPGA.N14), sram (SRAM.42)
EBI_WEn: arm_sheet (GG.B6), fpga_sheet (FPGA.L14), sram (SRAM.15)
GPIO0: arm_sheet (GG.H4), user_interface (R25.2)
GPIO1: arm_sheet (GG.H5), user_interface (R26.2)
GPIO2: arm_sheet (GG.J5), user_interface (R27.2)
GPIO3: arm_sheet (GG.J6), user_interface (R28.2)
GPIO4: arm_sheet (GG.K5), user_interface (R29.2)
GPIO5: arm_sheet (GG.D3), user_interface (B4.1 C54.2 R15.1)
GPIO6: arm_sheet (GG.C11), user_interface (B5.1 C55.2 R16.1)
GPIO7: arm_sheet (GG.L11), user_interface (B6.1 C56.2 R17.1)
GPIO8: arm_sheet (GG.K11), user_interface (B7.1 C57.2 R18.1)
GPIO9: arm_sheet (GG.J9), user_interface (B8.1 C58.2 R19.1)
GPIO10: arm_sheet (GG.J10), user_interface (GG_GPIO.1)
GPIO11: arm_sheet (GG.H8), user_interface (GG_GPIO.2)
GPIO12: arm_sheet (GG.B5), user_interface (GG_GPIO.3)
GPIO13: arm_sheet (GG.C5), user_interface (GG_GPIO.4)
GPIO14: arm_sheet (GG.C4), user_interface (GG_GPIO.5)
GPIO15: arm_sheet (GG.H3), user_interface (GG_GPIO.6)
GPIO16: arm_sheet (GG.J3), user_interface (GG_GPIO.7)
GPIO17: arm_sheet (GG.F10), user_interface (GG_GPIO.8)
GPIO18: arm_sheet (GG.E11), user_interface (GG_GPIO.9)
GPIO19: arm_sheet (GG.A7), user_interface (GG_GPIO.10)
GPIO_FPGA0: user_interface (R12.2), fpga_sheet (FPGA.B2)
GPIO_FPGA1: user_interface (R13.2), fpga_sheet (FPGA.A2)
GPIO_FPGA2: user_interface (B2.1 C52.2 R9.1), fpga_sheet (FPGA.D6)
GPIO_FPGA3: user_interface (B3.1 C53.2 R10.1), fpga_sheet (FPGA.C6)
GPIO_FPGA4: user_interface (FPGA_GPIO.1), fpga_sheet (FPGA.B3)
GPIO_FPGA5: user_interface (FPGA_GPIO.2), fpga_sheet (FPGA.A3)
GPIO_FPGA6: user_interface (FPGA_GPIO.3), fpga_sheet (FPGA.B4)
GPIO_FPGA7: user_interface (FPGA_GPIO.4), fpga_sheet (FPGA.A4)
GPIO_FPGA8: user_interface (FPGA_GPIO.5), fpga_sheet (FPGA.C5)
GPIO_FPGA9: user_interface (FPGA_GPIO.6), fpga_sheet (FPGA.A5)
GPIO_FPGA10: user_interface (FPGA_GPIO.7), fpga_sheet (FPGA.B6)
GPIO_FPGA11: user_interface (FPGA_GPIO.8), fpga_sheet (FPGA.A6)
GPIO_FPGA12: user_interface (FPGA_GPIO.9), fpga_sheet (FPGA.C7)
GPIO_FPGA13: user_interface (FPGA_GPIO.10), fpga_sheet (FPGA.A7)
GPIO_FPGA14: user_interface (FPGA_GPIO.11), fpga_sheet (FPGA.D8)
GPIO_FPGA15: user_interface (FPGA_GPIO.12), fpga_sheet (FPGA.C8)
NetC62_1: arm_sheet (GG.H10), audio_interface (C62.1 R35.1)
NetC66_1: arm_sheet (GG.H11), audio_interface (C66.1 R43.1)
NetCG1_3: oscillation (CG1.3), fpga_sheet (FPGA.L12)
NetGG_A6: arm_sheet (GG.A6), uart_usb_bridge (P_UART.1 U3.1)
NetGG_B7: arm_sheet (GG.B7), uart_usb_bridge (P_UART.2 U3.5)
NetGG_H9: arm_sheet (GG.H9), power_supply (S2.3 SNS12.1)
NetGG_J11: arm_sheet (GG.J11), power_supply (S1.3 SNS33.1)
NetGG_L5: arm_sheet (GG.L5), audio_interface (MJOUT.2)
NetGG_L6: arm_sheet (GG.L6), audio_interface (MJOUT.1)
US2_CLK: arm_sheet (GG.K2), user_interface (SD.5)
US2_CS: arm_sheet (GG.L2), user_interface (SD.2)
US2_RX: arm_sheet (GG.J2), user_interface (SD.7)
US2_TX: arm_sheet (GG.H2), user_interface (SD.3)